# EAGLE board ControlBoard03_v03_short (EAGLE 7.7.0), part 1 of 3
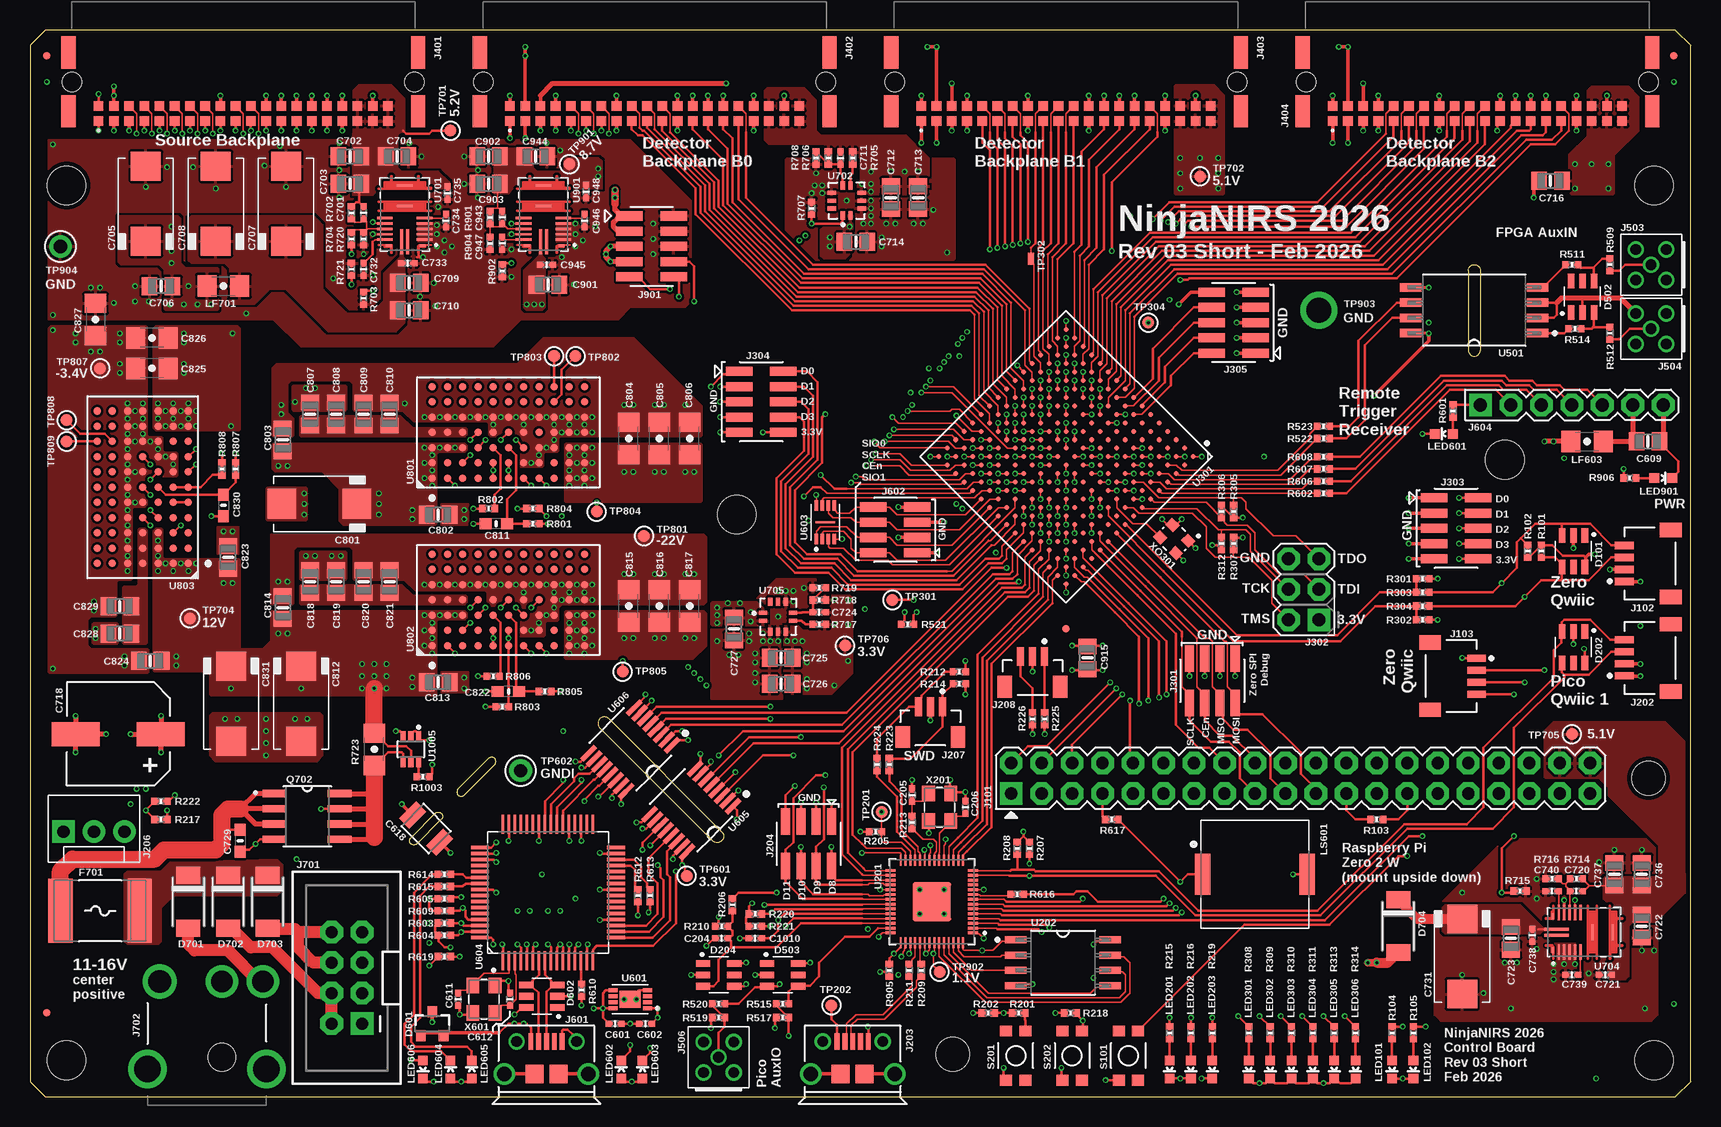
[diagram p10: board, top side]
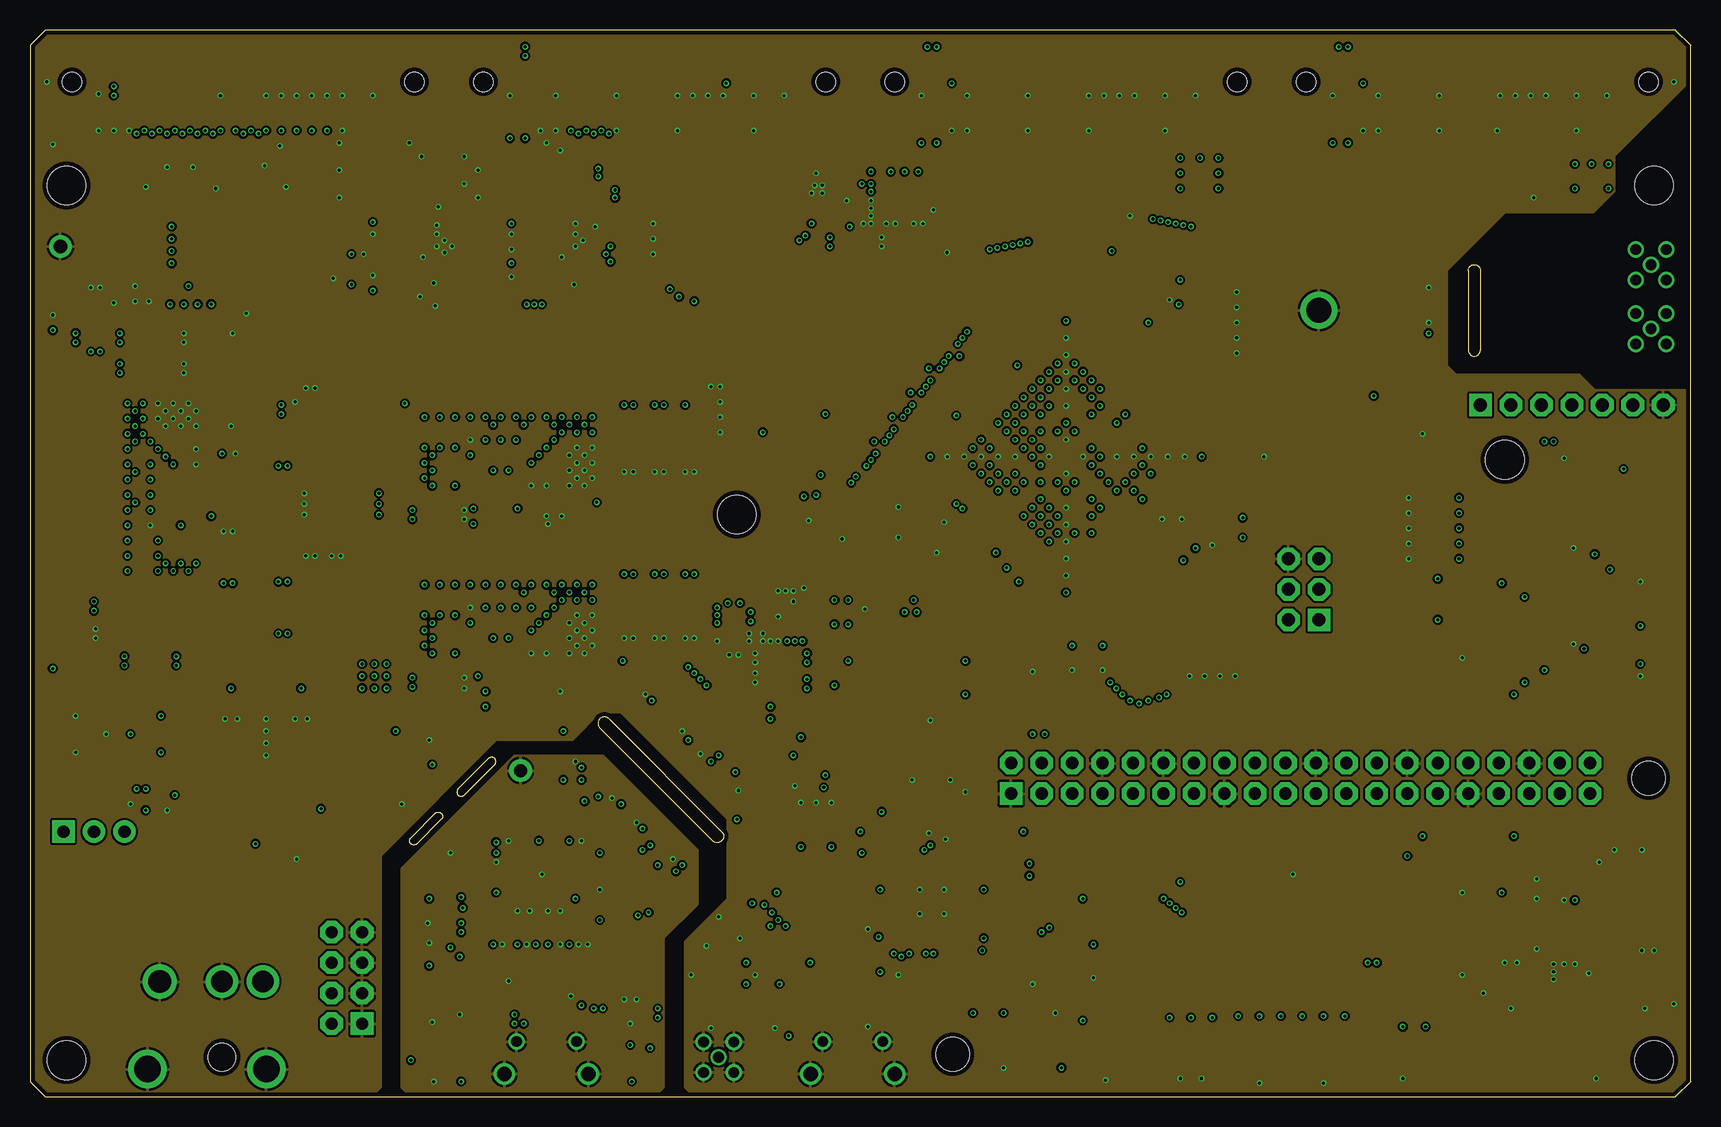
[diagram p11: board, inner layer Route2]
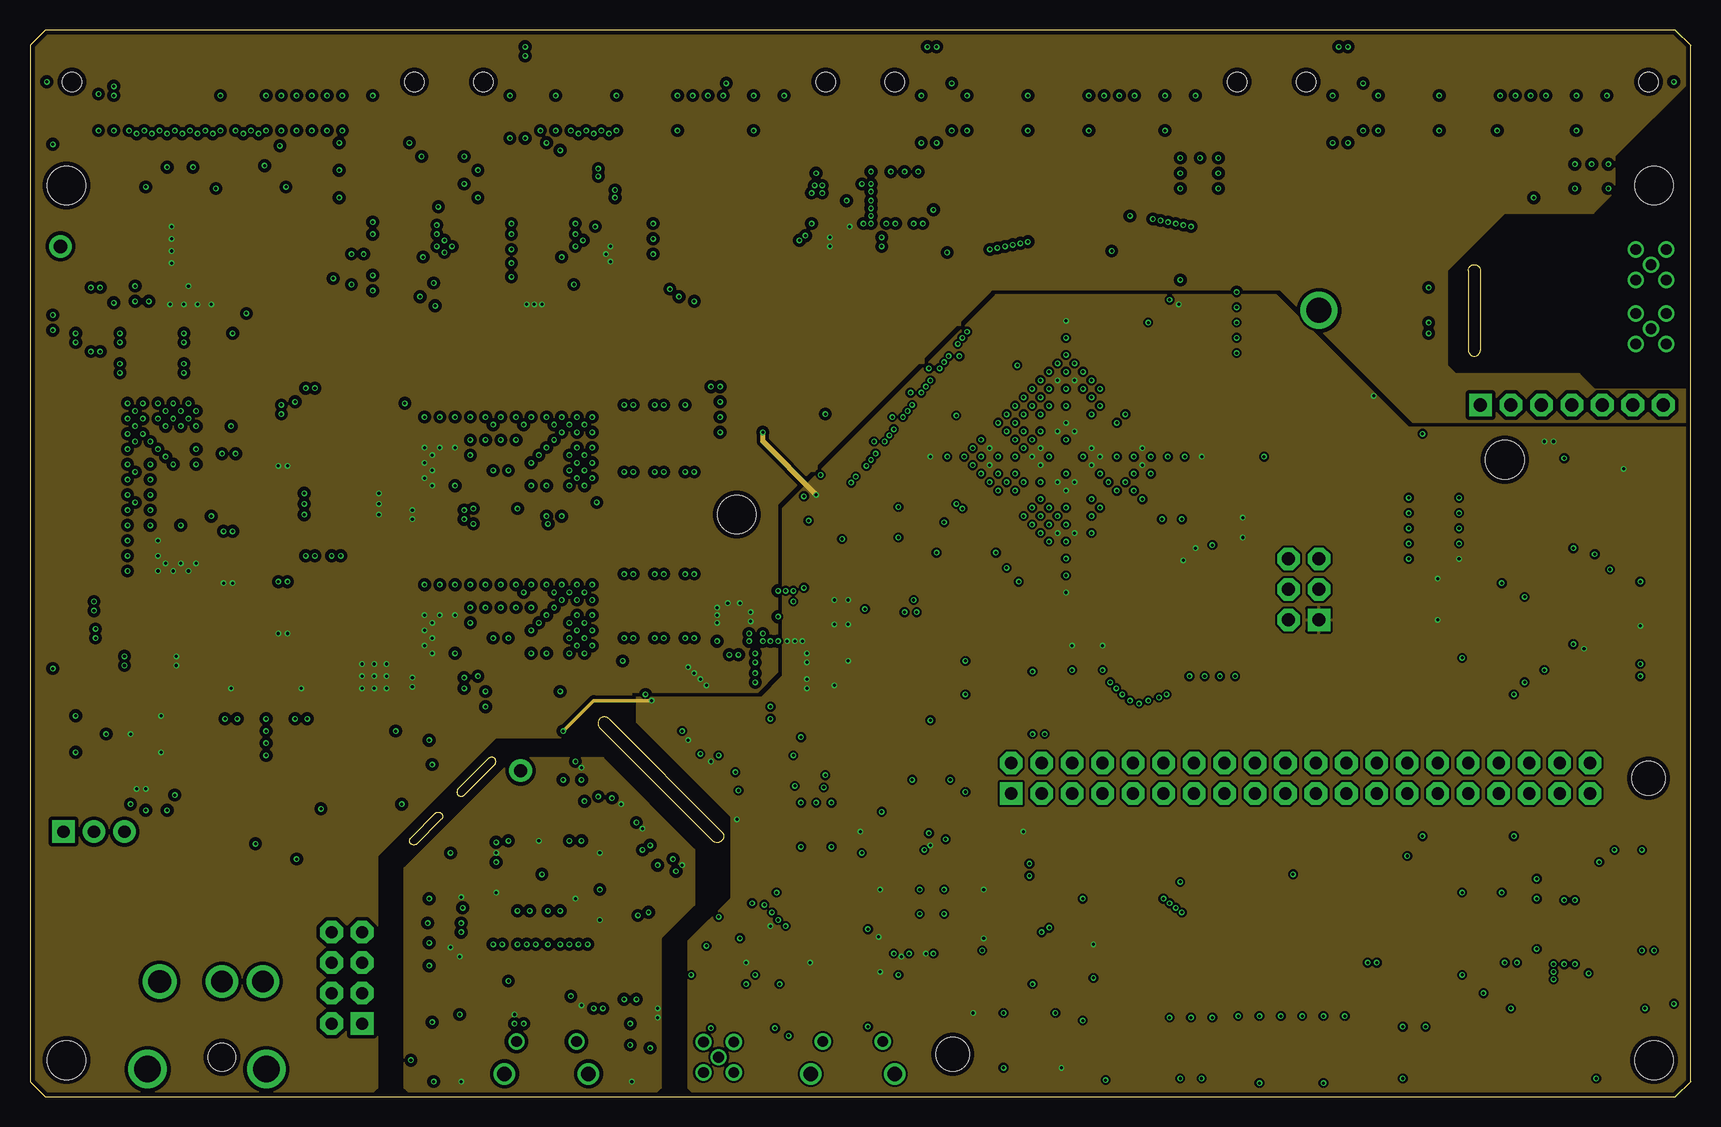
[diagram p12: board, inner layer Route3]
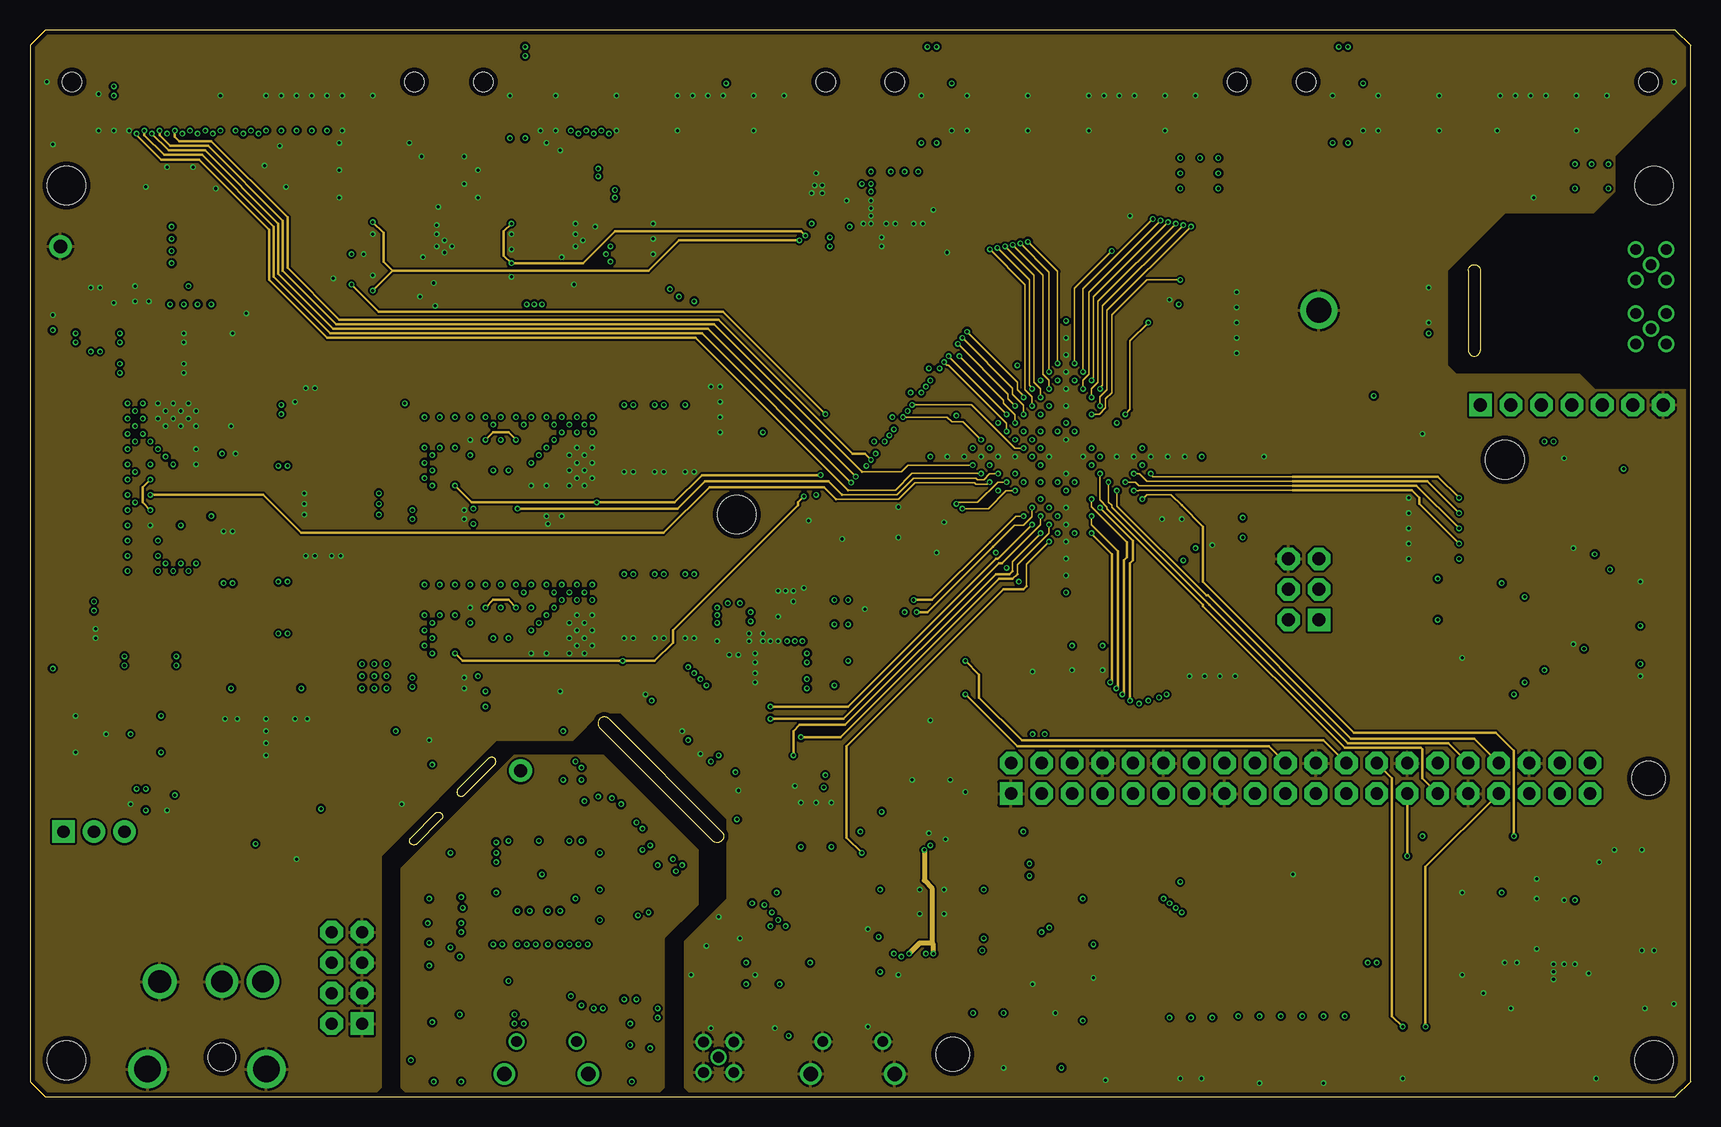
[diagram p13: board, inner layer Route14]
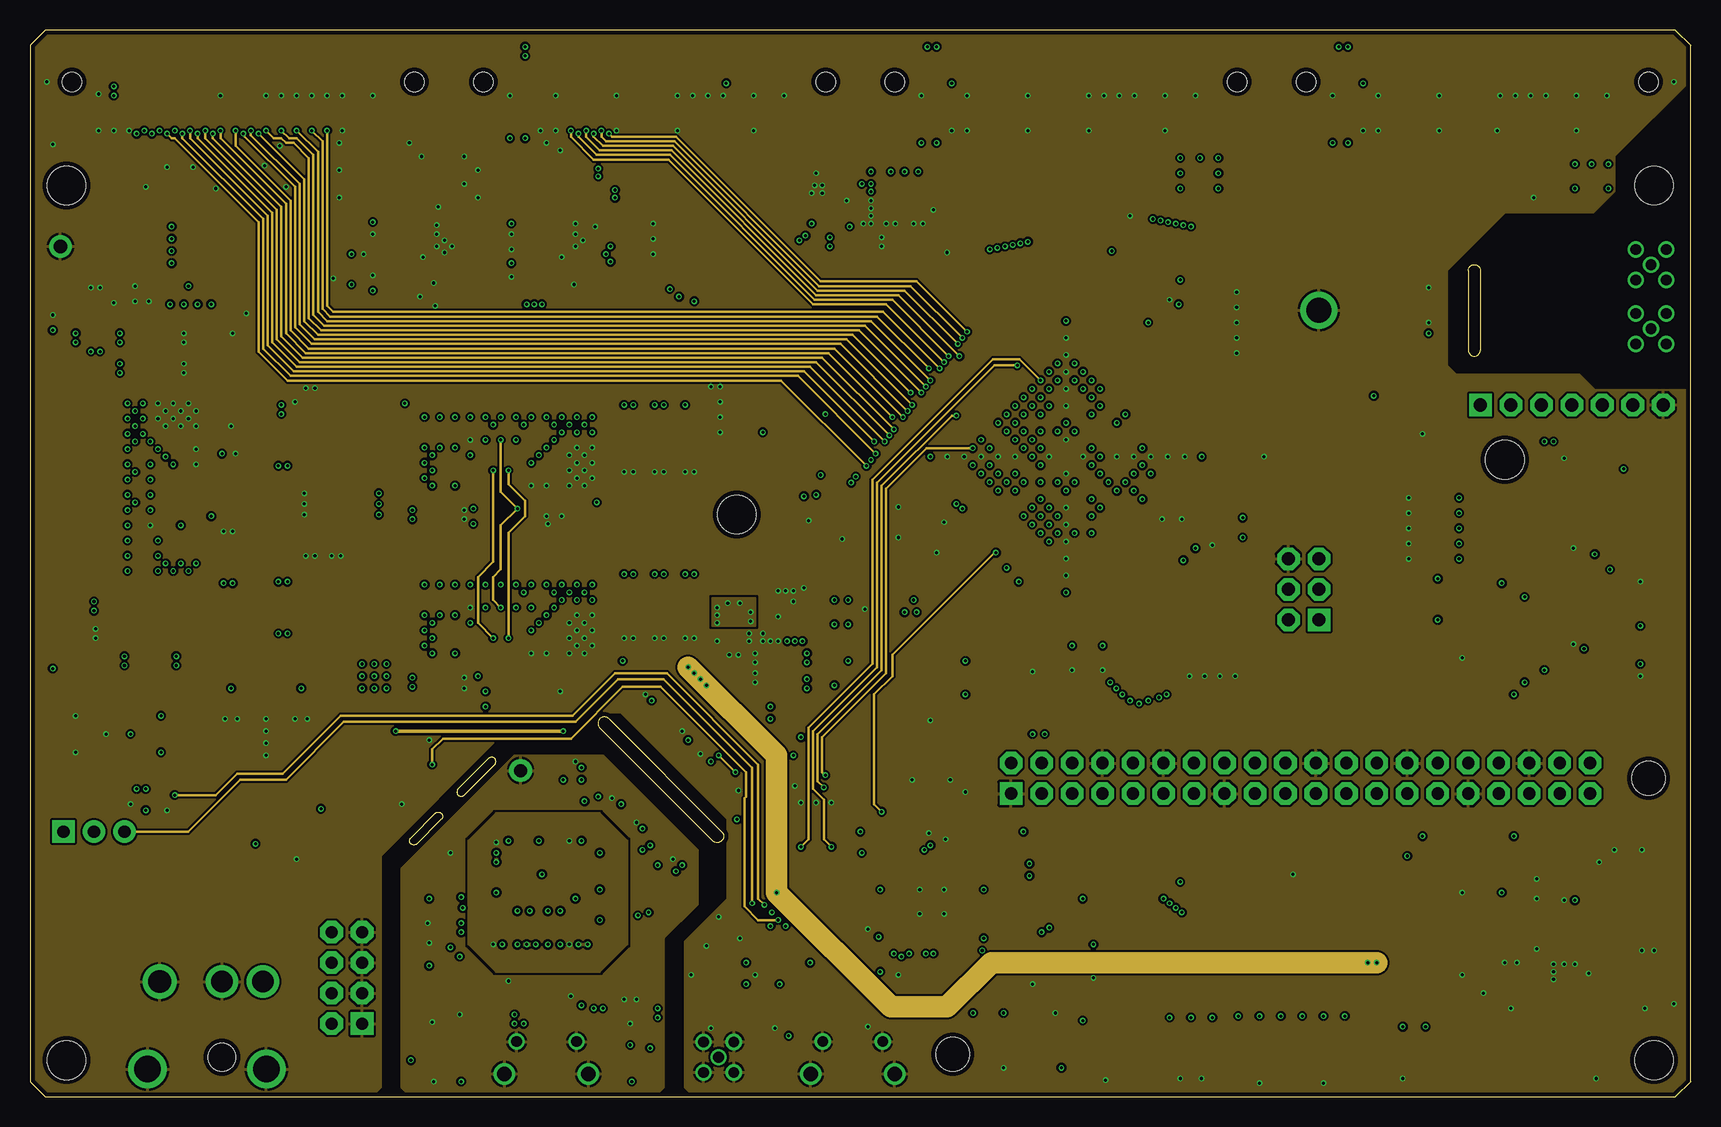
[diagram p14: board, inner layer Route15]
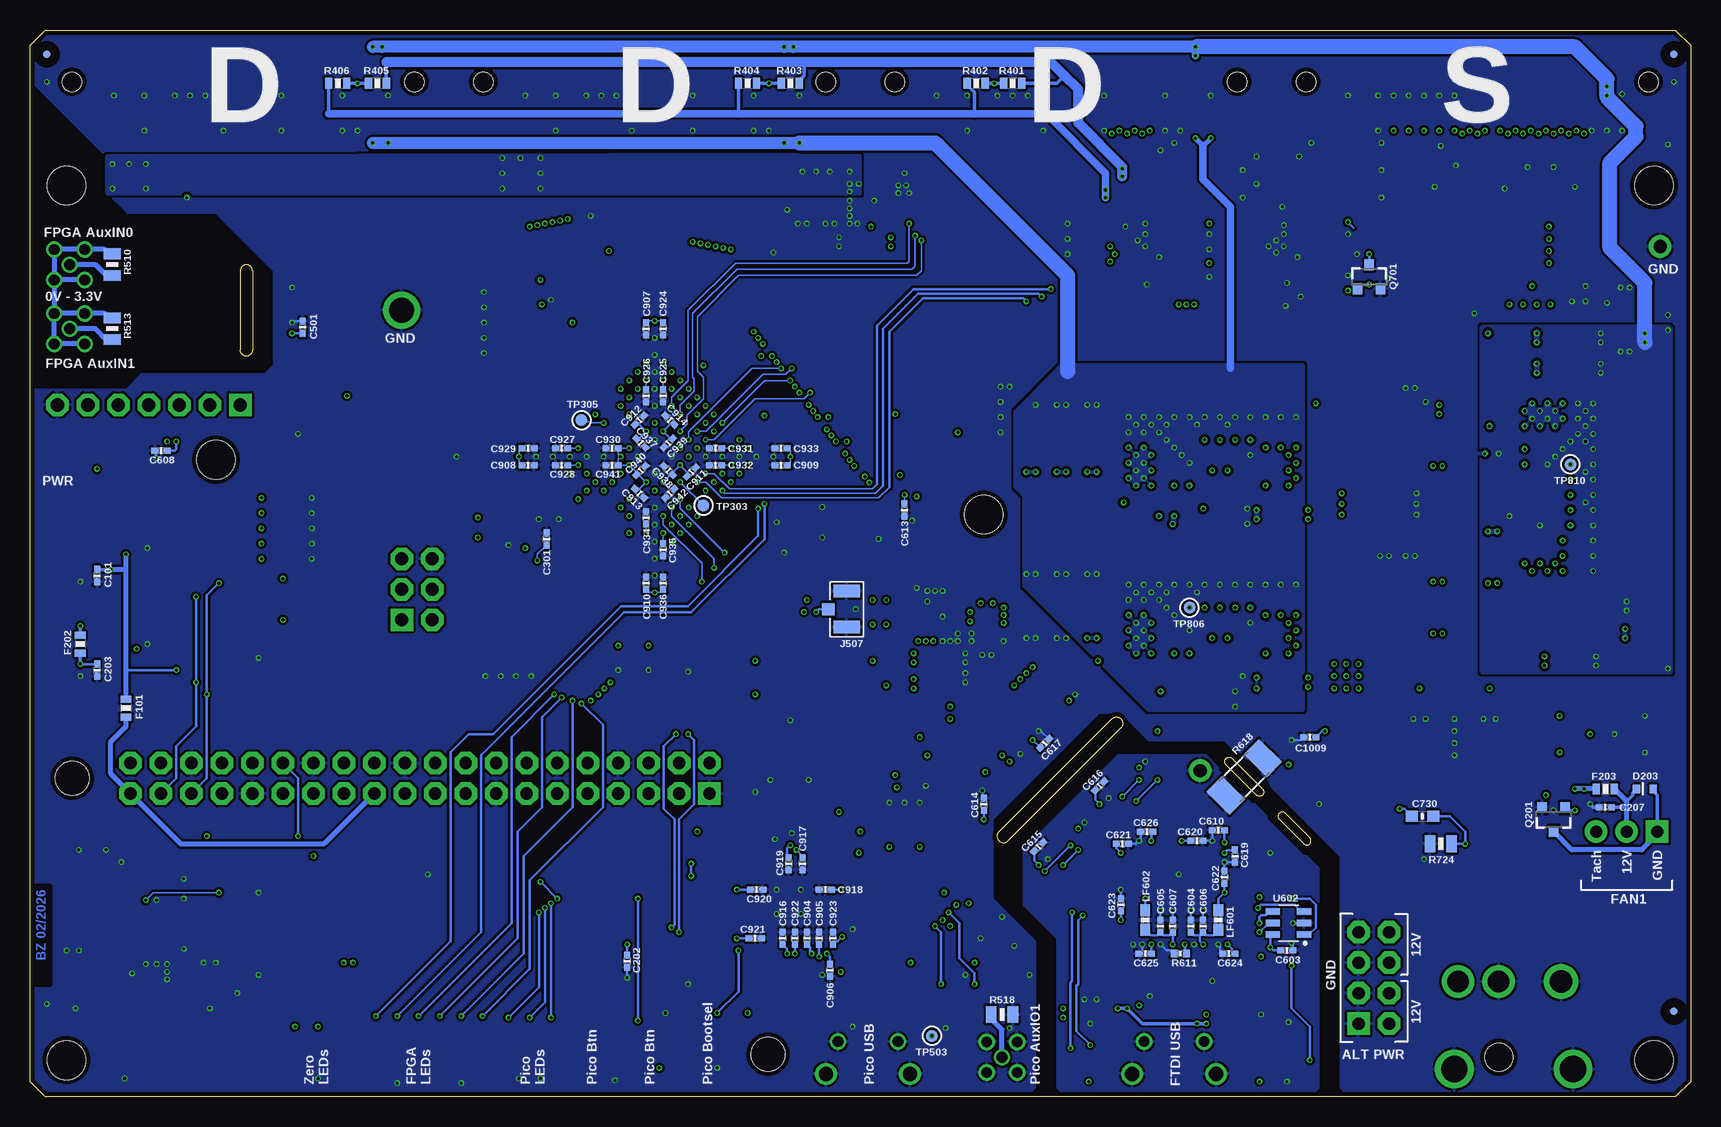
[diagram p15: board, bottom side, seen from below]

Size 138.43 x 88.9 mm. Coordinates in mm from the lower left corner, seen from the top.
Outline: 1.27,0 137.16,0 138.43,1.27 138.43,87.63 137.16,88.9 1.27,88.9 0,87.63 0,1.27 1.27,0
Outline: 48.26,31.5 57.66,22.1 arc-180 56.9,21.34 47.5,30.73 arc-180 48.26,31.5
Outline: 33.78,23.62 31.75,21.59 arc180 32.26,21.08 34.29,23.11 arc180 33.78,23.62
Outline: 35.69,25.65 38.23,28.19 arc-180 38.73,27.69 36.2,25.15 arc-180 35.69,25.65
Outline: 119.89,68.83 119.89,62.23 arc180 120.9,62.23 120.9,68.83 arc180 119.89,68.83
Copper layers (1*2*3*14*15*16): Top 0.04318125mm / dielectric 0.11074375mm / Route2 0.017271875mm / dielectric 4mil / Route3 0.017271875mm / dielectric 0.925575mm / Route14 0.017271875mm / dielectric 4mil / Route15 0.017271875mm / dielectric 0.11074375mm / Bottom 0.04318125mm
Design rules "ControlBoard00_v01_DRCsnapshot *": minimum track width 5mil, minimum drill 10mil, track to track 5mil, track to pad 5mil, pad to pad 5mil, via to via 5mil, smd to smd 5mil, copper to edge 15mil, drill to drill 6mil, minimum pad ring 4mil, minimum via ring 4mil, stop-mask expansion 1.5mil, vias tented up to drill 12mil, thermal gap 8mil
Holes 3.2 mm at 3.05,3.05 135.38,3.05 3.05,75.95 135.38,75.95 122.94,53.09 58.93,48.51
Holes 2.8 mm at 134.92,26.54 76.92,3.54
tKeepout: area 132.3,72.9 to 138.4,79; area 0,72.9 to 6.1,79; area 0,0 to 6.1,6.1; area 132.3,0 to 138.4,6.1; area 55.9,45.5 to 62,51.6
tRestrict: 23 lines
bRestrict: 3 lines

## Footprints (pad centres in the part's own frame; a part is rotated, then mirrored left to right if it is on the bottom)
0402-CAP = smd 0.6 x 0.5: 1 -0.5,0; 2 0.5,0
0805-CAP = smd 1.3 x 1.5: 1 -0.95,0; 2 0.95,0
1210 = smd 1.2 x 2: 1 -1.6,0; 2 1.6,0
2917-CAP = smd 2.4 x 2.5: N 3.125,0; P -3.125,0
CAP-SMD-POL-8X10 = smd 2 x 4: N 0,-3.55; P 0,3.55
0603-CAP = smd 1 x 0.9: 1 -0.9,0; 2 0.9,0
1206 = smd 1.6 x 1.8: 1 -1.35,0; 2 1.35,0
SOT23-6 = smd 1.2 x 0.55: 1 -1.3,0.95; 2 -1.3,0; 3 -1.3,-0.95; 4 1.3,-0.95; 5 1.3,0; 6 1.3,0.95
SOD523 = smd 0.6 x 0.7: A -0.7,0; C 0.7,0
SOT23-3 = smd 0.9 x 0.8: 1 -1,0.95; 2 -1,-0.95; 3 1,0
SOD128 = smd 1.4 x 2: A -2.2,0; C 2.2,0
0603-RES = smd 0.6 x 0.9: 1 -0.75,0; 2 0.75,0
2920-FUSE = smd 2.032 x 5.334: 1 -3.302,0; 2 3.302,0
MICRO-FIDUCIAL = smd 0.635 x 0.635: 1 0,0
M20X2_PTH = drill 1.016 pad 1.88 square: 1 -1.27,24.13 | drill 1.016 pad 1.88 octagon: 2 1.27,24.13; 3 -1.27,21.59; 4 1.27,21.59; 5 -1.27,19.05; 6 1.27,19.05; 7 -1.27,16.51; 8 1.27,16.51; 9 -1.27,13.97; 10 1.27,13.97; 11 -1.27,11.43; 12 1.27,11.43; 13 -1.27,8.89; 14 1.27,8.89; 15 -1.27,6.35; 16 1.27,6.35; 17 -1.27,3.81; 18 1.27,3.81; 19 -1.27,1.27; 20 1.27,1.27; 21 -1.27,-1.27; 22 1.27,-1.27; 23 -1.27,-3.81; 24 1.27,-3.81; 25 -1.27,-6.35; 26 1.27,-6.35; 27 -1.27,-8.89; 28 1.27,-8.89; 29 -1.27,-11.43; 30 1.27,-11.43; 31 -1.27,-13.97; 32 1.27,-13.97; 33 -1.27,-16.51; 34 1.27,-16.51; 35 -1.27,-19.05; 36 1.27,-19.05; 37 -1.27,-21.59; 38 1.27,-21.59; 39 -1.27,-24.13; 40 1.27,-24.13
M04X1_JST_SH_SM_RA = smd 0.6 x 1.55: 1 -1.5,4.775; 2 -0.5,4.775; 3 0.5,4.775; 4 1.5,4.775 | smd 1.2 x 1.8: PAD1 -2.8,0.9; PAD2 2.8,0.9
USB-MICRO = smd 0.4 x 1.4: 1 -1.3,2.7; 2 -0.65,2.7; 3 0,2.7; 4 0.65,2.7; 5 1.3,2.7 | drill 0.9: SH1 -2.5,2.7; SH2 2.5,2.7 | drill 1.2: SH3 -3.5,0; SH6 3.5,0 | smd 1.5 x 1.55: SH4 -1,0; SH5 1,0
M04X2_0.050_SMD_NO_CREAM = smd 2.21 x 0.762: 1 -1.841,1.905; 2 1.841,1.905; 3 -1.841,0.635; 4 1.841,0.635; 5 -1.841,-0.635; 6 1.841,-0.635; 7 -1.841,-1.905; 8 1.841,-1.905
MOLEX-1X3 = drill 1.016 pad 1.88 square: 1 0,0 | drill 1.016 pad 1.88: 2 2.54,0; 3 5.08,0
M03X1_JST_SH_SM = smd 0.6 x 1.55: 1 -1,-3.425; 2 0,-3.425; 3 1,-3.425 | smd 1.2 x 1.8: PAD1 -2.3,-0.9; PAD2 2.3,-0.9
2X3-NS = drill 1.1 pad 1.88 square: 1 -2.54,-1.27 | drill 1.1 pad 1.88 octagon: 2 -2.54,1.27; 3 0,-1.27; 4 0,1.27; 5 2.54,-1.27; 6 2.54,1.27
M05X2_0.050_SMD_NO_CREAM = smd 2.21 x 0.762: 1 -1.841,2.54; 2 1.841,2.54; 3 -1.841,1.27; 4 1.841,1.27; 5 -1.841,0; 6 1.841,0; 7 -1.841,-1.27; 8 1.841,-1.27; 9 -1.841,-2.54; 10 1.841,-2.54
M20X2_HARFLEX_M = smd 0.8 x 0.8: A1 12.065,2; A2 10.795,2; A3 9.525,2; A4 8.255,2; A5 6.985,2; A6 5.715,2; A7 4.445,2; A8 3.175,2; A9 1.905,2; A10 0.635,2; A11 -0.635,2; A12 -1.905,2; A13 -3.175,2; A14 -4.445,2; A15 -5.715,2; A16 -6.985,2; A17 -8.255,2; A18 -9.525,2; A19 -10.795,2; A20 -12.065,2; B1 12.065,3.27; B2 10.795,3.27; B3 9.525,3.27; B4 8.255,3.27; B5 6.985,3.27; B6 5.715,3.27; B7 4.445,3.27; B8 3.175,3.27; B9 1.905,3.27; B10 0.635,3.27; B11 -0.635,3.27; B12 -1.905,3.27; B13 -3.175,3.27; B14 -4.445,3.27; B15 -5.715,3.27; B16 -6.985,3.27; B17 -8.255,3.27; B18 -9.525,3.27; B19 -10.795,3.27; B20 -12.065,3.27 | smd 1.2 x 2.7: P$17 -14.575,2.45; P$18 -14.575,-2.45; P$19 14.575,2.45; P$20 14.575,-2.45 | hole 1.6: -14.275,0; 14.275,0
MMCX_PTH_RA = drill 0.9: C 0,0; G@1 -1.27,1.27; G@2 -1.27,-1.27; G@3 1.27,-1.27; G@4 1.27,1.27
U.FL = smd 2.2 x 1.05: P$1 0,1.5; P$2 0,-1.5 | smd 1.05 x 1: P$3 1.525,0
M07X1_PTH = drill 1.1 pad 1.88 square: 1 -7.62,0 | drill 1.1 pad 1.88 octagon: 2 -5.08,0; 3 -2.54,0; 4 0,0; 5 2.54,0; 6 5.08,0; 7 7.62,0
M04X2-SHROUDED = drill 1.016 pad 1.88 square: 1 -1.27,3.81 | drill 1.016 pad 1.88 octagon: 2 1.27,3.81; 3 -1.27,1.27; 4 1.27,1.27; 5 -1.27,-1.27; 6 1.27,-1.27; 7 -1.27,-3.81; 8 1.27,-3.81
PJ051AH = drill 1.8: CENTER 6.3,-3.4; SWITCH 6.3,0 | drill 2.2: SHIELD1 -1,6.2; SHIELD2 -1,-3.7 | drill 1.9: SLEEVE 6.3,5.2 | hole 2.3: 0,0
LED-0603 = smd 0.8 x 0.8: A 0,-0.75; C 0,0.75
0603-FER = smd 1 x 0.8: 1 -0.8,0; 2 0.8,0
XDCR_PKMCS0909E4000-R1 = smd 1.3 x 3.4: 1 -4.35,0; 2 4.35,0
SO08 = smd 2 x 0.6: 1 -2.7,1.905; 2 -2.7,0.635; 3 -2.7,-0.635; 4 -2.7,-1.905; 5 2.7,-1.905; 6 2.7,-0.635; 7 2.7,0.635; 8 2.7,1.905
0402-RES = smd 0.6 x 0.6: 1 -0.5,0; 2 0.5,0
0805 = smd 0.9 x 1.4: 1 -0.9,0; 2 0.9,0
R2010 = smd 1.8 x 2.7: 1 -2.2,0; 2 2.2,0
TACTILE_SWITCH_SMD-3 = smd 0.9 x 1: 1 -2.05,0.8; 2 2.05,0.8; 3 -2.05,-0.8; 4 2.05,-0.8
TESTPAD_ROUND = smd 1.016 x 1.016: P$1 0,0
TESTPAD_SMALL = smd 1.016 x 0.508: P$1 0,0
1X01 = drill 1.1 pad 1.88: 1 0,0
TURRET = drill 2.08: P$1 0,0
QFN-56_EP = smd 0.875 x 0.2: 1 -3.438,2.6; 2 -3.438,2.2; 3 -3.438,1.8; 4 -3.438,1.4; 5 -3.438,1; 6 -3.438,0.6; 7 -3.438,0.2; 8 -3.438,-0.2; 9 -3.438,-0.6; 10 -3.438,-1; 11 -3.438,-1.4; 12 -3.438,-1.8; 13 -3.438,-2.2; 14 -3.438,-2.6; 29 3.438,-2.6; 30 3.438,-2.2; 31 3.438,-1.8; 32 3.438,-1.4; 33 3.438,-1; 34 3.438,-0.6; 35 3.438,-0.2; 36 3.438,0.2; 37 3.438,0.6; 38 3.438,1; 39 3.438,1.4; 40 3.438,1.8; 41 3.438,2.2; 42 3.438,2.6 | smd 0.2 x 0.875: 15 -2.6,-3.438; 16 -2.2,-3.438; 17 -1.8,-3.438; 18 -1.4,-3.438; 19 -1,-3.438; 20 -0.6,-3.438; 21 -0.2,-3.438; 22 0.2,-3.438; 23 0.6,-3.438; 24 1,-3.438; 25 1.4,-3.438; 26 1.8,-3.438; 27 2.2,-3.438; 28 2.6,-3.438; 43 2.6,3.438; 44 2.2,3.438; 45 1.8,3.438; 46 1.4,3.438; 47 1,3.438; 48 0.6,3.438; 49 0.2,3.438; 50 -0.2,3.438; 51 -0.6,3.438; 52 -1,3.438; 53 -1.4,3.438; 54 -1.8,3.438; 55 -2.2,3.438; 56 -2.6,3.438 | smd 3.2 x 3.2: PAD 0,0
SO08-208MIL = smd 1.778 x 0.584: 1 -3.937,1.905; 2 -3.937,0.635; 3 -3.937,-0.635; 4 -3.937,-1.905; 5 3.937,-1.905; 6 3.937,-0.635; 7 3.937,0.635; 8 3.937,1.905
LBGA-256 = smd 0.4 x 0.4: A1 -7.5,7.5; A2 -6.5,7.5; A3 -5.5,7.5; A4 -4.5,7.5; A5 -3.5,7.5; A6 -2.5,7.5; A7 -1.5,7.5; A8 -0.5,7.5; A9 0.5,7.5; A10 1.5,7.5; A11 2.5,7.5; A12 3.5,7.5; A13 4.5,7.5; A14 5.5,7.5; A15 6.5,7.5; A16 7.5,7.5; B1 -7.5,6.5; B2 -6.5,6.5; B3 -5.5,6.5; B4 -4.5,6.5; B5 -3.5,6.5; B6 -2.5,6.5; B7 -1.5,6.5; B8 -0.5,6.5; B9 0.5,6.5; B10 1.5,6.5; B11 2.5,6.5; B12 3.5,6.5; B13 4.5,6.5; B14 5.5,6.5; B15 6.5,6.5; B16 7.5,6.5; C1 -7.5,5.5; C2 -6.5,5.5; C3 -5.5,5.5; C4 -4.5,5.5; C5 -3.5,5.5; C6 -2.5,5.5; C7 -1.5,5.5; C8 -0.5,5.5; C9 0.5,5.5; C10 1.5,5.5; C11 2.5,5.5; C12 3.5,5.5; C13 4.5,5.5; C14 5.5,5.5; C15 6.5,5.5; C16 7.5,5.5; D1 -7.5,4.5; D2 -6.5,4.5; D3 -5.5,4.5; D4 -4.5,4.5; D5 -3.5,4.5; D6 -2.5,4.5; D7 -1.5,4.5; D8 -0.5,4.5; D9 0.5,4.5; D10 1.5,4.5; D11 2.5,4.5; D12 3.5,4.5; D13 4.5,4.5; D14 5.5,4.5; D15 6.5,4.5; D16 7.5,4.5; E1 -7.5,3.5; E2 -6.5,3.5; E3 -5.5,3.5; E4 -4.5,3.5; E5 -3.5,3.5; E6 -2.5,3.5; E7 -1.5,3.5; E8 -0.5,3.5; E9 0.5,3.5; E10 1.5,3.5; E11 2.5,3.5; E12 3.5,3.5; E13 4.5,3.5; E14 5.5,3.5; E15 6.5,3.5; E16 7.5,3.5; F1 -7.5,2.5; F2 -6.5,2.5; F3 -5.5,2.5; F4 -4.5,2.5; F5 -3.5,2.5; F6 -2.5,2.5; F7 -1.5,2.5; F8 -0.5,2.5; F9 0.5,2.5; F10 1.5,2.5; F11 2.5,2.5; F12 3.5,2.5; F13 4.5,2.5; F14 5.5,2.5; F15 6.5,2.5; F16 7.5,2.5; G1 -7.5,1.5; G2 -6.5,1.5; G3 -5.5,1.5; G4 -4.5,1.5; G5 -3.5,1.5; G6 -2.5,1.5; G7 -1.5,1.5; G8 -0.5,1.5; G9 0.5,1.5; G10 1.5,1.5; G11 2.5,1.5; G12 3.5,1.5; G13 4.5,1.5; G14 5.5,1.5; G15 6.5,1.5; G16 7.5,1.5; H1 -7.5,0.5; H2 -6.5,0.5; H3 -5.5,0.5; H4 -4.5,0.5; H5 -3.5,0.5; H6 -2.5,0.5; H7 -1.5,0.5; H8 -0.5,0.5; H9 0.5,0.5; H10 1.5,0.5; H11 2.5,0.5; H12 3.5,0.5; H13 4.5,0.5; H14 5.5,0.5; H15 6.5,0.5; H16 7.5,0.5; J1 -7.5,-0.5; J2 -6.5,-0.5; J3 -5.5,-0.5; J4 -4.5,-0.5; J5 -3.5,-0.5; J6 -2.5,-0.5; J7 -1.5,-0.5; J8 -0.5,-0.5; J9 0.5,-0.5; J10 1.5,-0.5; J11 2.5,-0.5; J12 3.5,-0.5; J13 4.5,-0.5; J14 5.5,-0.5; J15 6.5,-0.5; J16 7.5,-0.5; K1 -7.5,-1.5; K2 -6.5,-1.5; K3 -5.5,-1.5; K4 -4.5,-1.5; K5 -3.5,-1.5; K6 -2.5,-1.5; K7 -1.5,-1.5; K8 -0.5,-1.5; K9 0.5,-1.5; K10 1.5,-1.5; K11 2.5,-1.5; K12 3.5,-1.5; K13 4.5,-1.5; K14 5.5,-1.5; K15 6.5,-1.5; K16 7.5,-1.5; L1 -7.5,-2.5; L2 -6.5,-2.5; L3 -5.5,-2.5; L4 -4.5,-2.5; L5 -3.5,-2.5; L6 -2.5,-2.5; L7 -1.5,-2.5; L8 -0.5,-2.5; L9 0.5,-2.5; L10 1.5,-2.5; L11 2.5,-2.5; L12 3.5,-2.5; L13 4.5,-2.5; L14 5.5,-2.5; L15 6.5,-2.5; L16 7.5,-2.5; M1 -7.5,-3.5; M2 -6.5,-3.5; M3 -5.5,-3.5; M4 -4.5,-3.5; M5 -3.5,-3.5; M6 -2.5,-3.5; M7 -1.5,-3.5; M8 -0.5,-3.5; M9 0.5,-3.5; M10 1.5,-3.5; M11 2.5,-3.5; M12 3.5,-3.5; M13 4.5,-3.5; M14 5.5,-3.5; M15 6.5,-3.5; M16 7.5,-3.5; N1 -7.5,-4.5; N2 -6.5,-4.5; N3 -5.5,-4.5; N4 -4.5,-4.5; N5 -3.5,-4.5; N6 -2.5,-4.5; N7 -1.5,-4.5; N8 -0.5,-4.5; N9 0.5,-4.5; N10 1.5,-4.5; N11 2.5,-4.5; N12 3.5,-4.5; N13 4.5,-4.5; N14 5.5,-4.5; N15 6.5,-4.5; N16 7.5,-4.5; P1 -7.5,-5.5; P2 -6.5,-5.5; P3 -5.5,-5.5; P4 -4.5,-5.5; P5 -3.5,-5.5; P6 -2.5,-5.5; P7 -1.5,-5.5; P8 -0.5,-5.5; P9 0.5,-5.5; P10 1.5,-5.5; P11 2.5,-5.5; P12 3.5,-5.5; P13 4.5,-5.5; P14 5.5,-5.5; P15 6.5,-5.5; P16 7.5,-5.5; R1 -7.5,-6.5; R2 -6.5,-6.5; R3 -5.5,-6.5; R4 -4.5,-6.5; R5 -3.5,-6.5; R6 -2.5,-6.5; R7 -1.5,-6.5; R8 -0.5,-6.5; R9 0.5,-6.5; R10 1.5,-6.5; R11 2.5,-6.5; R12 3.5,-6.5; R13 4.5,-6.5; R14 5.5,-6.5; R15 6.5,-6.5; R16 7.5,-6.5; T1 -7.5,-7.5; T2 -6.5,-7.5; T3 -5.5,-7.5; T4 -4.5,-7.5; T5 -3.5,-7.5; T6 -2.5,-7.5; T7 -1.5,-7.5; T8 -0.5,-7.5; T9 0.5,-7.5; T10 1.5,-7.5; T11 2.5,-7.5; T12 3.5,-7.5; T13 4.5,-7.5; T14 5.5,-7.5; T15 6.5,-7.5; T16 7.5,-7.5
SO08L = smd 1.8 x 0.7: 1 -5.3,1.905; 2 -5.3,0.635; 3 -5.3,-0.635; 4 -5.3,-1.905; 5 5.3,-1.905; 6 5.3,-0.635; 7 5.3,0.635; 8 5.3,1.905
DFN8_2X3MM = smd 0.75 x 0.3: 1 -1.45,0.75; 2 -1.45,0.25; 3 -1.45,-0.25; 4 -1.45,-0.75; 5 1.45,-0.75; 6 1.45,-0.25; 7 1.45,0.25; 8 1.45,0.75 | smd 1.75 x 1.45: P 0,0
USON8L-2X3MM_APM = smd 0.85 x 0.3: 1 -1.4,0.75; 2 -1.4,0.25; 3 -1.4,-0.25; 4 -1.4,-0.75; 5 1.4,-0.75; 6 1.4,-0.25; 7 1.4,0.25; 8 1.4,0.75 | smd 0.2 x 1.6: PAD 0,0
QFP50P1200X1200X160-64N = smd 1.56 x 0.28: 1 -5.68,3.75; 2 -5.68,3.25; 3 -5.68,2.75; 4 -5.68,2.25; 5 -5.68,1.75; 6 -5.68,1.25; 7 -5.68,0.75; 8 -5.68,0.25; 9 -5.68,-0.25; 10 -5.68,-0.75; 11 -5.68,-1.25; 12 -5.68,-1.75; 13 -5.68,-2.25; 14 -5.68,-2.75; 15 -5.68,-3.25; 16 -5.68,-3.75; 33 5.68,-3.75; 34 5.68,-3.25; 35 5.68,-2.75; 36 5.68,-2.25; 37 5.68,-1.75; 38 5.68,-1.25; 39 5.68,-0.75; 40 5.68,-0.25; 41 5.68,0.25; 42 5.68,0.75; 43 5.68,1.25; 44 5.68,1.75; 45 5.68,2.25; 46 5.68,2.75; 47 5.68,3.25; 48 5.68,3.75 | smd 0.28 x 1.56: 17 -3.75,-5.68; 18 -3.25,-5.68; 19 -2.75,-5.68; 20 -2.25,-5.68; 21 -1.75,-5.68; 22 -1.25,-5.68; 23 -0.75,-5.68; 24 -0.25,-5.68; 25 0.25,-5.68; 26 0.75,-5.68; 27 1.25,-5.68; 28 1.75,-5.68; 29 2.25,-5.68; 30 2.75,-5.68; 31 3.25,-5.68; 32 3.75,-5.68; 49 3.75,5.68; 50 3.25,5.68; 51 2.75,5.68; 52 2.25,5.68; 53 1.75,5.68; 54 1.25,5.68; 55 0.75,5.68; 56 0.25,5.68; 57 -0.25,5.68; 58 -0.75,5.68; 59 -1.25,5.68; 60 -1.75,5.68; 61 -2.25,5.68; 62 -2.75,5.68; 63 -3.25,5.68; 64 -3.75,5.68
SSOP16 = smd 1.6 x 0.406: 1 -2.692,2.223; 2 -2.692,1.587; 3 -2.692,0.953; 4 -2.692,0.318; 5 -2.692,-0.318; 6 -2.692,-0.953; 7 -2.692,-1.587; 8 -2.692,-2.223; 9 2.692,-2.223; 10 2.692,-1.587; 11 2.692,-0.953; 12 2.692,-0.318; 13 2.692,0.318; 14 2.692,0.953; 15 2.692,1.587; 16 2.692,2.223
QFN-24-MPS_FULL_CREAM = smd 0.5 x 0.2: 1_24 -1.5,2.6; 20_21 1.35,2.6 | smd 1.3 x 0.2: 2 -1.65,2.1; 3 -1.65,1.65; 4 -1.65,1.2; 5 -1.65,0.75; 6 -1.65,0.3; 7_8_13_14 0,-0.7; 9_10_11_12 0,-2.4; 15 1.65,0.3; 16 1.65,0.75; 17 1.65,1.2; 18 1.65,1.65; 19 1.65,2.1 | smd 0.25 x 2.05: 22 0.25,2.275; 23 -0.25,2.275
RPL-30 = smd 0.7 x 0.35: 1 -1.25,0.325; 2 -1.25,-0.325; 6 1.25,-0.325; 7 1.25,0.325 | smd 0.35 x 0.7: 3 -0.65,-1.25; 4 0,-1.25; 5 0.65,-1.25; 8 0.65,1.25; 9 0,1.25; 10 -0.65,1.25
BGA-77 = smd 0.63 x 0.63: A1 -3.81,6.35; A2 -2.54,6.35; A3 -1.27,6.35; A4 0,6.35; A5 1.27,6.35; A6 2.54,6.35; A7 3.81,6.35; B1 -3.81,5.08; B2 -2.54,5.08; B3 -1.27,5.08; B4 0,5.08; B5 1.27,5.08; B6 2.54,5.08; B7 3.81,5.08; C1 -3.81,3.81; C2 -2.54,3.81; C3 -1.27,3.81; C4 0,3.81; C5 1.27,3.81; C6 2.54,3.81; C7 3.81,3.81; D1 -3.81,2.54; D2 -2.54,2.54; D3 -1.27,2.54; D4 0,2.54; D5 1.27,2.54; D6 2.54,2.54; D7 3.81,2.54; E1 -3.81,1.27; E2 -2.54,1.27; E3 -1.27,1.27; E4 0,1.27; E5 1.27,1.27; E6 2.54,1.27; E7 3.81,1.27; F1 -3.81,0; F2 -2.54,0; F3 -1.27,0; F4 0,0; F5 1.27,0; F6 2.54,0; F7 3.81,0; G1 -3.81,-1.27; G2 -2.54,-1.27; G3 -1.27,-1.27; G4 0,-1.27; G5 1.27,-1.27; G6 2.54,-1.27; G7 3.81,-1.27; H1 -3.81,-2.54; H2 -2.54,-2.54; H3 -1.27,-2.54; H4 0,-2.54; H5 1.27,-2.54; H6 2.54,-2.54; H7 3.81,-2.54; J1 -3.81,-3.81; J2 -2.54,-3.81; J3 -1.27,-3.81; J4 0,-3.81; J5 1.27,-3.81; J6 2.54,-3.81; J7 3.81,-3.81; K1 -3.81,-5.08; K2 -2.54,-5.08; K3 -1.27,-5.08; K4 0,-5.08; K5 1.27,-5.08; K6 2.54,-5.08; K7 3.81,-5.08; L1 -3.81,-6.35; L2 -2.54,-6.35; L3 -1.27,-6.35; L4 0,-6.35; L5 1.27,-6.35; L6 2.54,-6.35; L7 3.81,-6.35
SOT363 = smd 0.42 x 0.9: 1 -0.65,-1.05; 2 0,-1.05; 3 0.65,-1.05; 4 0.65,1.05; 5 0,1.05; 6 -0.65,1.05
CRYSTAL-3.2-2.5 = smd 1.3 x 1.05: 1 -1.15,-0.925; 2 1.15,-0.925; 3 1.15,0.925; 4 -1.15,0.925
TXO2520 = smd 0.9 x 0.8: 1 -0.925,-0.725; 2 0.925,-0.725; 3 0.925,0.725; 4 -0.925,0.725

## Placement (x,y rotation side)
C101  0.1u  [0402-CAP]  132.84,43.43 270 bottom
C202  0.1u  [0402-CAP]  88.65,11.3 270 bottom
C203  0.1u  [0402-CAP]  132.84,35.56 270 bottom
C204  0.1u  [0402-CAP]  57.66,13.21 180 top
C205  27p  [0402-CAP]  73.53,25.15 90 top
C206  27p  [0402-CAP]  77.98,24.13 90 top
C207  0.1u  [0402-CAP]  7.11,24.13 180 bottom
C301  0.1u  [0402-CAP]  95.38,46.48 90 bottom
C501  0.1u  [0402-CAP]  115.7,64.14 90 bottom
C601  4.7u  [0402-CAP]  48.77,6.1 0 top
C602  4.7u  [0402-CAP]  51.31,6.1 180 top
C603  0.1u  [0402-CAP]  33.66,12.19 0 bottom
C604  4.7u  [0402-CAP]  41.66,14.22 90 bottom
C605  4.7u  [0402-CAP]  44.2,14.22 90 bottom
C606  0.1u  [0402-CAP]  40.64,14.22 90 bottom
C607  0.1u  [0402-CAP]  43.18,14.22 90 bottom
C608  0.1u  [0402-CAP]  127.51,53.85 180 bottom
C609  22u  [0805-CAP]  134.87,54.61 0 top
C610  4.7u  [0402-CAP]  39.37,22.23 180 bottom
C611  27p  [0402-CAP]  35.69,8.13 270 top
C612  27p  [0402-CAP]  40.01,8.13 90 top
C613  0.1u  [0402-CAP]  65.53,48.9 270 bottom
C614  0.1u  [0402-CAP]  58.93,24.38 90 bottom
C615  0.1u  [0402-CAP]  54.36,20.83 45 bottom
C616  0.1u  [0402-CAP]  49.28,25.91 45 bottom
C617  0.1u  [0402-CAP]  53.85,29.46 45 bottom
C618  DNP  [1210]  33.02,22.35 315 top
C619  0.1u  [0402-CAP]  37.97,20.07 270 bottom
C620  0.1u  [0402-CAP]  41.15,21.34 0 bottom
C621  0.1u  [0402-CAP]  47.37,21.08 0 bottom
C622  0.1u  [0402-CAP]  38.86,18.29 90 bottom
C623  0.1u  [0402-CAP]  47.5,16 90 bottom
C624  0.1u  [0402-CAP]  38.48,11.94 180 bottom
C625  0.1u  [0402-CAP]  45.47,11.94 180 bottom
C626  0.1u  [0402-CAP]  45.34,22.1 180 bottom
C701  39p  [0402-CAP]  27.81,73.66 270 top
C702  22u  [0805-CAP]  26.67,78.36 180 top
C703  22u  [0805-CAP]  26.67,76.07 180 top
C704  22u  [0805-CAP]  30.61,78.36 0 top
C705  100u/25V  [2917-CAP]  9.65,74.42 90 top
C706  22u  [0805-CAP]  10.92,67.56 180 top
C707  100u/25V  [2917-CAP]  21.34,74.42 90 top
C708  100u/25V  [2917-CAP]  15.49,74.42 90 top
C709  22u  [0805-CAP]  31.62,67.82 0 top
C710  22u  [0805-CAP]  31.62,65.53 0 top
C711  39p  [0402-CAP]  67.56,78.23 270 top
C712  22u  [0805-CAP]  71.75,74.93 270 top
C713  22u  [0805-CAP]  74.04,74.93 270 top
C714  22u  [0805-CAP]  68.83,71.25 0 top
C716  22u  [0805-CAP]  126.75,76.33 180 top
C718  330u/25V  [CAP-SMD-POL-8X10]  7.37,30.23 270 top
C720  39p  [0402-CAP]  128.91,17.14 180 top
C721  0.1u  [0402-CAP]  131.32,10.16 180 top
C722  22u  [0805-CAP]  134.37,14.22 270 top
C723  22u  [0805-CAP]  123.44,13.21 270 top
C724  39p  [0402-CAP]  65.79,40.39 180 top
C725  22u  [0805-CAP]  62.61,36.58 180 top
C726  22u  [0805-CAP]  62.61,34.42 180 top
C727  22u  [0805-CAP]  58.67,38.99 270 top
C729  10n  [0603-CAP]  17.53,21.34 270 top
C730  1n  [0603-CAP]  22.35,23.37 0 bottom
C731  100u/25V  [2917-CAP]  119.38,11.68 270 top
C732  0.1u  [0402-CAP]  27.81,68.96 270 top
C733  0.1u  [0402-CAP]  31.5,69.47 0 top
C734  DNP  [0402-CAP]  34.67,73.03 270 top
C735  0.1u  [0402-CAP]  34.8,75.31 270 top
C736  22u  [0805-CAP]  134.37,18.54 90 top
C737  22u  [0805-CAP]  132.08,18.54 90 top
C738  0.1u  [0402-CAP]  125.22,13.46 270 top
C739  DNP  [0402-CAP]  128.52,10.16 180 top
C740  0.1u  [0402-CAP]  126.87,17.14 180 top
C801  DNP  [2917-CAP]  24.13,49.4 180 top
C802  DNP  [0805-CAP]  34.04,48.51 0 top
C803  DNP  [0805-CAP]  21.08,54.74 90 top
C804  DNP  [1206]  49.91,54.86 90 top
C805  DNP  [1206]  52.45,54.86 90 top
C806  DNP  [1206]  54.99,54.86 90 top
C807  DNP  [0805-CAP]  23.37,56.9 90 top
C808  DNP  [0805-CAP]  25.53,56.9 90 top
C809  DNP  [0805-CAP]  27.81,56.9 90 top
C810  DNP  [0805-CAP]  29.97,56.9 90 top
C811  DNP  [0603-CAP]  38.86,47.75 180 top
C812  100u/25V  [2917-CAP]  22.61,32.77 270 top
C813  4.7u  [0805-CAP]  34.04,34.54 0 top
C814  4.7u  [0805-CAP]  21.08,40.77 90 top
C815  10u  [1206]  49.91,40.89 90 top
C816  10u  [1206]  52.45,40.89 90 top
C817  10u  [1206]  54.99,40.89 90 top
C818  4.7u  [0805-CAP]  23.37,42.93 90 top
C819  4.7u  [0805-CAP]  25.53,42.93 90 top
C820  4.7u  [0805-CAP]  27.81,42.93 90 top
C821  4.7u  [0805-CAP]  29.97,42.93 90 top
C822  1u  [0603-CAP]  39.88,33.78 180 top
C823  4.7u  [0805-CAP]  16.51,44.96 90 top
C824  4.7u  [0805-CAP]  10.03,36.32 180 top
C825  100u  [1206]  10.16,60.71 180 top
C826  100u  [1206]  10.16,63.25 180 top
C827  DNP  [1206]  5.46,64.77 270 top
C828  4.7u  [0805-CAP]  7.49,38.61 180 top
C829  4.7u  [0805-CAP]  7.49,40.89 180 top
C830  1u  [0603-CAP]  16.13,49.28 270 top
C831  100u/25V  [2917-CAP]  16.76,32.77 270 top
C901  22u  [0805-CAP]  43.18,67.69 0 top
C902  22u  [0805-CAP]  38.23,78.36 180 top
C903  22u  [0805-CAP]  38.23,76.07 180 top
C904  4.7u  [0402-CAP]  73.66,13.21 90 bottom
C905  4.7u  [0402-CAP]  72.64,13.21 90 bottom
C906  4.7u  [0402-CAP]  71.75,10.54 270 bottom
C907  4.7u  [0402-CAP]  87.07,64.01 270 bottom
C908  4.7u  [0402-CAP]  96.9,52.63 0 bottom
C909  4.7u  [0402-CAP]  75.82,52.63 180 bottom
C910  4.7u  [0402-CAP]  87.07,42.8 90 bottom
C911  4.7u  [0402-CAP]  83.31,52.07 45 bottom
C912  4.7u  [0402-CAP]  87.63,56.39 45 bottom
C913  4.7u  [0402-CAP]  87.63,50.29 315 bottom
C914  4.7u  [0402-CAP]  85.09,56.39 135 bottom
C915  22u  [0805-CAP]  88.14,36.58 270 top
C916  0.1u  [0402-CAP]  75.69,13.21 90 bottom
C917  0.1u  [0402-CAP]  74.04,19.43 270 bottom
C918  0.1u  [0402-CAP]  72.14,17.27 180 bottom
C919  0.1u  [0402-CAP]  75.18,19.43 270 bottom
C920  0.1u  [0402-CAP]  77.85,17.27 0 bottom
C921  0.1u  [0402-CAP]  77.98,13.21 0 bottom
C922  0.1u  [0402-CAP]  74.68,13.21 90 bottom
C923  0.1u  [0402-CAP]  71.5,13.21 90 bottom
C924  0.1u  [0402-CAP]  85.65,64.01 270 bottom
C925  0.1u  [0402-CAP]  85.65,58.42 270 bottom
C926  0.1u  [0402-CAP]  87.07,58.42 270 bottom
C927  0.1u  [0402-CAP]  94.11,54.05 180 bottom
C928  0.1u  [0402-CAP]  94.11,52.63 180 bottom
C929  0.1u  [0402-CAP]  96.9,54.05 0 bottom
C930  0.1u  [0402-CAP]  89.92,54.05 180 bottom
C931  0.1u  [0402-CAP]  81.28,54.05 180 bottom
C932  0.1u  [0402-CAP]  81.28,52.63 180 bottom
C933  0.1u  [0402-CAP]  75.82,54.05 180 bottom
C934  0.1u  [0402-CAP]  87.07,48.26 90 bottom
C935  0.1u  [0402-CAP]  85.65,45.59 270 bottom
C936  0.1u  [0402-CAP]  85.65,42.8 90 bottom
C937  0.1u  [0402-CAP]  87.5,54.48 315 bottom
C938  0.1u  [0402-CAP]  85.22,52.2 135 bottom
C939  0.1u  [0402-CAP]  85.22,54.48 225 bottom
C940  0.1u  [0402-CAP]  87.5,52.2 45 bottom
C941  0.1u  [0402-CAP]  89.92,52.63 180 bottom
C942  0.1u  [0402-CAP]  85.09,50.29 225 bottom
C943  39p  [0402-CAP]  39.37,73.28 270 top
C944  22u  [0805-CAP]  42.16,78.36 0 top
C945  0.1u  [0402-CAP]  43.05,69.34 0 top
C946  DNP  [0402-CAP]  46.23,73.03 270 top
C947  0.1u  [0402-CAP]  39.37,71.12 270 top
C948  0.1u  [0402-CAP]  46.35,75.44 270 top
C1009  0.1u  [0402-CAP]  31.75,29.97 180 bottom
C1010  0.1u  [0402-CAP]  60.45,13.21 180 top
D101  D1213A-02SO  [SOT23-6]  128.65,45.47 270 top
D202  D1213A-02SO  [SOT23-6]  128.65,37.47 270 top
D203  [SOD523]  3.81,25.65 180 bottom
D204  D1213A-02SO  [SOT23-6]  57.4,10.16 0 top
D502  D1213A-02SO  [SOT23-6]  129.41,66.67 90 top
D503  D1213A-02SO  [SOT23-6]  62.74,10.16 0 top
D601  PACDN042  [SOT23-3]  33.53,6.1 90 top
D602  D1213A-02SO  [SOT23-6]  42.67,8.38 180 top
D701  [SOD128]  13.21,16.26 90 top
D702  [SOD128]  16.51,16.26 90 top
D703  [SOD128]  19.81,16.26 90 top
D704  [SOD128]  114.05,14.22 90 top
F101  0ZCM0010FF2G  [0603-RES]  130.43,32.38 270 bottom
F202  0ZCM0010FF2G  [0603-RES]  134.24,37.72 270 bottom
F203  0ZCM0010FF2G  [0603-RES]  7.11,25.65 0 bottom
F701  2920L500/16MR  [2920-FUSE]  5.84,15.49 180 top
FID901  FIDUCIALUFIDUCIAL  [MICRO-FIDUCIAL]  1.4,6.99 0 top
FID902  FIDUCIALUFIDUCIAL  [MICRO-FIDUCIAL]  1.4,86.74 0 top
FID903  FIDUCIALUFIDUCIAL  [MICRO-FIDUCIAL]  137.03,86.74 0 top
FID904  FIDUCIALUFIDUCIAL  [MICRO-FIDUCIAL]  86.36,38.99 0 top
FID905  FIDUCIALUFIDUCIAL  [MICRO-FIDUCIAL]  1.4,7.11 0 bottom
FID906  FIDUCIALUFIDUCIAL  [MICRO-FIDUCIAL]  1.4,86.87 0 bottom
FID907  FIDUCIALUFIDUCIAL  [MICRO-FIDUCIAL]  137.03,86.87 0 bottom
J101  M20X2_PTH  [M20X2_PTH]  105.92,26.54 90 top
J102  M04X1_JST_SH_RA  [M04X1_JST_SH_SM_RA]  137.67,44.45 90 top
J103  M04X1_JST_SH_RA  [M04X1_JST_SH_SM_RA]  115.82,35.05 270 top
J202  M04X1_JST_SH_RA  [M04X1_JST_SH_SM_RA]  137.67,36.58 90 top
J203  USB-MICRO  [USB-MICRO]  68.58,1.91 0 top
J204  M04X2_0.050_SMD_NO_CREAM  [M04X2_0.050_SMD_NO_CREAM]  64.9,21.08 270 top
J206  [MOLEX-1X3]  2.79,22.1 0 top
J207  M03X1_JST_SH  [M03X1_JST_SH_SM]  75.06,29.08 180 top
J208  M03X1_JST_SH  [M03X1_JST_SH_SM]  83.57,33.27 180 top
J301  M04X2_0.050_SMD_NO_CREAM  [M04X2_0.050_SMD_NO_CREAM]  98.55,34.67 270 top
J302  M03X2PTH  [2X3-NS]  106.17,42.29 90 top
J303  M05X2_SMD_0.050_NOCREAM  [M05X2_0.050_SMD_NO_CREAM]  118.87,47.37 0 top
J304  M05X2_SMD_0.050_NOCREAM  [M05X2_0.050_SMD_NO_CREAM]  60.96,57.91 0 top
J305  M05X2_SMD_0.050_NOCREAM  [M05X2_0.050_SMD_NO_CREAM]  100.33,64.52 180 top
J401  M20X2_HARFLEX_M  [M20X2_HARFLEX_M]  17.78,84.58 180 top
J402  M20X2_HARFLEX_M  [M20X2_HARFLEX_M]  52.07,84.58 180 top
J403  M20X2_HARFLEX_M  [M20X2_HARFLEX_M]  86.36,84.58 180 top
J404  M20X2_HARFLEX_M  [M20X2_HARFLEX_M]  120.65,84.58 180 top
J503  SMA_MMCX_PTH_RA  [MMCX_PTH_RA]  135.13,69.34 90 top
J504  SMA_MMCX_PTH_RA  [MMCX_PTH_RA]  135.13,64.01 90 top
J506  SMA_MMCX_PTH_RA  [MMCX_PTH_RA]  57.4,3.3 0 top
J507  U.FL  [U.FL]  70.36,40.64 180 bottom
J601  USB-MICRO  [USB-MICRO]  43.05,1.91 0 top
J602  M04X2_0.050_SMD_NO_CREAM  [M04X2_0.050_SMD_NO_CREAM]  72.14,47.24 180 top
J604  M07X1_PTH  [M07X1_PTH]  128.52,57.66 0 top
J701  M04X2_SHROUDED  [M04X2-SHROUDED]  26.42,9.91 180 top
J702  POWERJACK_PJ051AH  [PJ051AH]  16,3.3 90 top
J901  M05X2_SMD_0.050_NOCREAM  [M05X2_0.050_SMD_NO_CREAM]  51.82,70.87 0 top
LED101  LTST-C191TBKT-5A  [LED-0603]  113.54,2.29 180 top
LED102  LTST-C191KGKT  [LED-0603]  115.32,2.29 180 top
LED201  LTST-C191KRKT  [LED-0603]  95,2.29 180 top
LED202  LTST-C191KGKT  [LED-0603]  96.77,2.29 180 top
LED203  LTST-C191KSKT  [LED-0603]  98.55,2.29 180 top
LED301  LTST-C191KRKT  [LED-0603]  101.6,2.29 180 top
LED302  LTST-C191KGKT  [LED-0603]  103.38,2.29 180 top
LED303  LTST-C191TBKT-5A  [LED-0603]  105.16,2.29 180 top
LED304  LTST-C191KSKT  [LED-0603]  106.93,2.29 180 top
LED305  LTST-C191KRKT  [LED-0603]  108.71,2.29 180 top
LED306  LTST-C191KGKT  [LED-0603]  110.49,2.29 180 top
LED601  LTST-C191KSKT  [LED-0603]  117.86,55.24 90 top
LED602  LTST-C191KGKT  [LED-0603]  49.28,2.29 0 top
LED603  LTST-C191KRKT  [LED-0603]  51.05,2.29 0 top
LED604  LTST-C191KGKT  [LED-0603]  35.05,2.29 0 top
LED605  LTST-C191KRKT  [LED-0603]  36.83,2.29 0 top
LED606  LTST-C191KRKT  [LED-0603]  32.77,2.29 180 top
LED901  LTST-C191KGKT  [LED-0603]  136.14,51.56 270 top
LF601  FERRITE0603  [0603-FER]  39.37,14.73 270 bottom
LF602  FERRITE0603  [0603-FER]  45.47,14.73 270 bottom
LF603  FERRITE1206  [1206]  129.79,54.61 0 top
LF701  FERRITE1206  [1206]  16.13,67.56 0 top
LS601  PKMCS0909E4000-R1  [XDCR_PKMCS0909E4000-R1]  102.11,18.54 0 top
Q201  MOSFET-NCHANNELSMD  [SOT23-3]  11.43,23.11 270 bottom
Q701  MOSFET-NCHANNELSMD  [SOT23-3]  26.8,68.33 90 bottom
Q702  MOSFET-PCHANNEL_SO8  [SO08]  23.11,23.37 0 top
R101  10k  [0402-RES]  125.98,45.47 90 top
R102  10k  [0402-RES]  124.84,45.47 270 top
R103  10k  [0402-RES]  112.27,23.11 180 top
R104  470  [0402-RES]  113.54,5.33 90 top
R105  470  [0402-RES]  115.32,5.33 90 top
R201  1k  [0402-RES]  82.42,6.99 180 top
R202  DNP  [0402-RES]  79.88,6.99 180 top
R205  100k  [0402-RES]  70.48,22.1 180 top
R206  47k  [0402-RES]  58.55,16 90 top
R207  10k  [0402-RES]  83.31,20.7 90 top
R208  10k  [0402-RES]  82.3,20.7 90 top
R209  27  [0402-RES]  74.3,10.54 270 top
R210  10k  [0402-RES]  57.66,14.22 0 top
R211  27  [0402-RES]  73.28,10.54 270 top
R212  DNP  [0402-RES]  77.47,35.43 180 top
R213  1.2k  [0402-RES]  73.53,22.86 90 top
R214  DNP  [0402-RES]  77.47,34.42 180 top
R215  470  [0402-RES]  95,5.33 90 top
R216  470  [0402-RES]  96.77,5.33 90 top
R217  100k  [0402-RES]  10.92,23.11 180 top
R218  10k  [0402-RES]  86.74,6.99 0 top
R219  470  [0402-RES]  98.55,5.33 90 top
R220  470  [0402-RES]  60.45,15.24 180 top
R221  100k  [0402-RES]  60.45,14.22 0 top
R222  470  [0402-RES]  10.92,24.64 180 top
R223  100  [0402-RES]  71.63,27.69 90 top
R224  100  [0402-RES]  70.61,27.69 90 top
R225  100  [0402-RES]  84.58,31.5 90 top
R226  100  [0402-RES]  83.57,31.5 90 top
R301  10k  [0402-RES]  116.08,43.18 0 top
R302  10k  [0402-RES]  116.08,39.75 0 top
R303  DNP  [0402-RES]  116.08,42.04 0 top
R304  DNP  [0402-RES]  116.08,40.89 0 top
R305  10k  [0402-RES]  100.33,48.77 270 top
R306  10k  [0402-RES]  99.31,48.77 90 top
R307  10k  [0402-RES]  100.33,46.1 90 top
R308  470  [0402-RES]  101.6,5.33 90 top
R309  470  [0402-RES]  103.38,5.33 90 top
R310  470  [0402-RES]  105.16,5.33 90 top
R311  470  [0402-RES]  106.93,5.33 90 top
R312  10k  [0402-RES]  99.31,46.1 90 top
R313  470  [0402-RES]  108.71,5.33 90 top
R314  470  [0402-RES]  110.49,5.33 90 top
R401  0  [0603-RES]  56.52,84.45 180 bottom
R402  DNP  [0603-RES]  59.56,84.45 0 bottom
R403  0  [0603-RES]  75.06,84.45 180 bottom
R404  DNP  [0603-RES]  78.61,84.45 0 bottom
R405  0  [0603-RES]  109.47,84.45 180 bottom
R406  DNP  [0603-RES]  112.78,84.45 0 bottom
R509  100  [0402-RES]  131.7,69.34 90 top
R510  DNP  [0805]  131.57,69.34 270 bottom
R511  470  [0402-RES]  128.52,69.34 180 top
R512  100  [0402-RES]  131.7,63.63 90 top
R513  DNP  [0805]  131.57,64.01 270 bottom
R514  470  [0402-RES]  128.78,64.01 180 top
R515  100  [0402-RES]  62.74,7.75 0 top
R517  10k  [0402-RES]  62.74,6.6 0 top
R518  DNP  [0805]  57.4,6.86 180 bottom
R519  10k  [0402-RES]  57.4,6.6 0 top
R520  100  [0402-RES]  57.4,7.75 0 top
R521  100  [0402-RES]  73.15,39.37 0 top
R522  100  [0402-RES]  107.82,54.86 180 top
R523  100  [0402-RES]  107.82,55.88 180 top
R601  470  [0402-RES]  118.62,57.15 270 top
R602  1k  [0402-RES]  107.82,50.29 0 top
R603  10k  [0402-RES]  34.54,14.48 180 top
R604  10k  [0402-RES]  34.54,13.46 180 top
R605  10k  [0402-RES]  34.54,16.51 0 top
R606  1k  [0402-RES]  107.82,51.31 0 top
R607  1k  [0402-RES]  107.82,52.32 0 top
R608  1k  [0402-RES]  107.82,53.34 0 top
R609  3.48k  [0402-RES]  34.54,15.49 0 top
R610  1k  [0402-RES]  45.97,8.89 90 top
R611  12k  [0402-RES]  42.55,11.94 0 bottom
R612  1k  [0402-RES]  50.67,16.76 270 top
R613  1k  [0402-RES]  51.69,16.76 270 top
R614  1k  [0402-RES]  34.54,18.54 180 top
R615  1k  [0402-RES]  34.54,17.53 180 top
R616  1k  [0402-RES]  82.3,16.89 180 top
R617  1k  [0402-RES]  90.17,23.11 180 top
R618  4.7M  [R2010]  37.21,26.67 225 bottom
R619  1k  [0402-RES]  34.54,11.68 0 top
R702  47k  [0402-RES]  26.8,73.66 90 top
R703  100k  [0402-RES]  27.81,66.55 90 top
R704  6.2k  [0402-RES]  26.8,71.5 90 top
R705  1k  [0402-RES]  68.58,78.23 90 top
R706  47k  [0402-RES]  66.55,78.23 90 top
R707  100k  [0402-RES]  65.15,74.04 270 top
R708  8.66k  [0402-RES]  65.53,78.23 90 top
R714  47k  [0402-RES]  128.91,18.16 0 top
R715  100k  [0402-RES]  124.21,17.14 180 top
R716  6.2k  [0402-RES]  126.87,18.16 0 top
R717  1k  [0402-RES]  65.79,39.37 0 top
R718  47k  [0402-RES]  65.79,41.4 0 top
R719  15k  [0402-RES]  65.79,42.42 0 top
R720  6.2k  [0402-RES]  27.81,71.5 90 top
R721  100k  [0402-RES]  26.8,68.96 270 top
R723  0.01  [1206]  28.7,28.96 90 top
R724  10M  [0805]  20.83,21.08 0 bottom
R801  DNP  [0402-RES]  41.91,47.75 0 top
R802  DNP  [0402-RES]  38.23,49.02 0 top
R803  442k  [0402-RES]  39.37,32.51 180 top
R804  100k  [0402-RES]  41.91,49.02 0 top
R805  82  [0402-RES]  42.93,33.78 0 top
R806  180k  [0402-RES]  38.61,35.05 0 top
R807  15  [0402-RES]  17.14,52.32 90 top
R808  68k  [0402-RES]  16,52.32 90 top
R901  47k  [0402-RES]  38.35,73.28 90 top
R902  100k  [0402-RES]  39.37,68.83 90 top
R904  3.48k  [0402-RES]  38.35,71.12 90 top
R905  100  [0402-RES]  71.63,10.54 90 top
R906  1k  [0402-RES]  133.35,51.56 180 top
R1003  470  [0402-RES]  32.77,26.67 0 top
S101  SWITCH-MOMENTARY-2SMD-3  [TACTILE_SWITCH_SMD-3]  91.57,3.43 90 top
S201  SWITCH-MOMENTARY-2SMD-3  [TACTILE_SWITCH_SMD-3]  82.17,3.43 90 top
S202  SWITCH-MOMENTARY-2SMD-3  [TACTILE_SWITCH_SMD-3]  86.87,3.43 270 top
TP201  TESTPOINT_ROUND  [TESTPAD_ROUND]  70.99,23.75 0 top
TP202  TESTPOINT_ROUND  [TESTPAD_ROUND]  66.8,7.62 0 top
TP301  TESTPOINT_ROUND  [TESTPAD_ROUND]  71.88,41.4 0 top
TP302  TESTPOINTPADSMALL  [TESTPAD_SMALL]  83.44,69.85 90 top
TP303  TESTPOINT_ROUND  [TESTPAD_ROUND]  82.3,49.28 0 bottom
TP304  TESTPOINT_ROUND  [TESTPAD_ROUND]  93.22,64.52 0 top
TP305  TESTPOINT_ROUND  [TESTPAD_ROUND]  92.46,56.39 0 bottom
TP503  TESTPOINT_ROUND  [TESTPAD_ROUND]  63.25,5.08 90 bottom
TP601  TESTPOINT_ROUND  [TESTPAD_ROUND]  54.74,18.41 0 top
TP602  TESTPOINT1X01  [1X01]  40.89,27.18 270 top
TP701  TESTPOINT_ROUND  [TESTPAD_ROUND]  35.05,80.52 0 top
TP702  TESTPOINT_ROUND  [TESTPAD_ROUND]  97.54,76.71 180 top
TP704  TESTPOINT_ROUND  [TESTPAD_ROUND]  13.34,39.88 0 top
TP705  TESTPOINT_ROUND  [TESTPAD_ROUND]  128.52,30.23 0 top
TP706  TESTPOINT_ROUND  [TESTPAD_ROUND]  67.94,37.59 90 top
TP801  TESTPOINT_ROUND  [TESTPAD_ROUND]  51.18,46.74 270 top
TP802  TESTPOINT_ROUND  [TESTPAD_ROUND]  45.47,61.72 270 top
TP803  TESTPOINT_ROUND  [TESTPAD_ROUND]  43.69,61.72 270 top
TP804  TESTPOINT_ROUND  [TESTPAD_ROUND]  47.24,48.77 0 top
TP805  TESTPOINT_ROUND  [TESTPAD_ROUND]  49.4,35.43 0 top
TP806  TESTPOINT_ROUND  [TESTPAD_ROUND]  41.78,40.77 90 bottom
TP807  TESTPOINT_ROUND  [TESTPAD_ROUND]  5.84,60.71 180 top
TP808  TESTPOINT_ROUND  [TESTPAD_ROUND]  3.05,56.39 180 top
TP809  TESTPOINT_ROUND  [TESTPAD_ROUND]  3.05,54.61 180 top
TP810  TESTPOINT_ROUND  [TESTPAD_ROUND]  10.03,52.7 180 bottom
TP901  TESTPOINT_ROUND  [TESTPAD_ROUND]  44.96,77.72 45 top
TP902  TESTPOINT_ROUND  [TESTPAD_ROUND]  75.82,10.41 0 top
TP903  TESTPOINTTUR  [TURRET]  107.44,65.53 0 top
TP904  TESTPOINT1X01  [1X01]  2.54,70.87 0 top
U201  RP2040  [QFN-56_EP]  75.18,16.26 180 top
U202  W25Q_SO  [SO08-208MIL]  86.11,11.18 0 top
U301  MACHXO2_FTBGA256  [LBGA-256]  86.36,53.34 225 top
U501  TLP2270  [SO08L]  120.38,65.54 180 top
U601  MCP1755_DFN  [DFN8_2X3MM]  50.04,8.13 180 top
U602  93LC56  [SOT23-6]  33.53,14.48 180 bottom
U603  APS6404L_PAD  [USON8L-2X3MM_APM]  66.29,47.88 90 top
U604  FT2232H_QFP  [QFP50P1200X1200X160-64N]  43.18,17.02 90 top
U605  ISO7742_DBQ  [SSOP16]  55.12,23.88 225 top
U606  ISO7742_DBQ  [SSOP16]  50.04,28.96 225 top
U701  MPM3650  [QFN-24-MPS_FULL_CREAM]  31.24,73.53 180 top
U702  RPL-30  [RPL-30]  68.07,74.68 90 top
U704  MPM3650  [QFN-24-MPS_FULL_CREAM]  129.54,13.72 90 top
U705  RPL-30  [RPL-30]  62.36,40.01 0 top
U801  DNP  [BGA-77]  39.88,55.37 90 top
U802  LTM4651  [BGA-77]  39.88,41.4 90 top
U803  LTM4651  [BGA-77]  9.4,50.8 180 top
U901  MPM3650  [QFN-24-MPS_FULL_CREAM]  42.8,73.53 180 top
U1005  INA21X_DCK  [SOT363]  31.75,28.96 180 top
X201  403I35D12M00000  [CRYSTAL-3.2-2.5]  75.82,24.13 270 top
X601  403I35D12M00000  [CRYSTAL-3.2-2.5]  37.85,8.13 270 top
XO301  OSCILLATOR_TXO2520  [TXO2520]  95.38,46.48 135 top

## Tracks (layer width: path | path; a pad name or v marks a point on that pad's centre or on a via)
AUXIO0
  Top 0.127: U301.B3 95.58,52.63 96.01,52.2 104.01,52.2 106.68,54.86 106.68,55.24 R523.2
AUXIO0PRE
  Top 0.203: R511.2 127.76,69.08 127.75,69.08 126.24,67.56 125.8,67.56 U501.4
AUXIO1
  Top 0.127: U301.A3 95.65,51.93 95.76,51.82 104.27,51.82 R522.2
AUXIO1PRE
  Top 0.203: U501.1 127.91,63.64 R514.2
AUXIO2  (via drill 0.25)
  Top 0.127: U301.H13 v83.53,49.1
  Top 0.203: v73.91,40.39 73.65,40.12 R521.2
  Route14 0.127: v83.53,49.1 83.53,48.35 82.8,47.62 82.04,47.62 80.26,45.85
  Route14 0.203: 80.26,45.85 74.8,40.39 v73.91,40.39
BOOTSEL
  Top 0.203: S201.4 82.97,6.39 82.93,6.43 82.93,6.98 R201.1
DETB_END_CYC0
  Top 0.127: U301.R7 82.82,59.67 81.79,60.71 81.79,66.17
  Top 0.203: J402.B15 57.78,80.64 58.55,79.88 58.55,74.55 64.52,68.58 79.38,68.58 81.79,66.17
DETB_END_CYC1
  Top 0.127: U301.P1 87.77,62.63 87.88,62.74 87.88,69.72
  Top 0.203: J403.B15 92.08,80.64 88.9,77.47 88.9,70.74 87.88,69.72
DETB_END_CYC2
  Top 0.127: U301.J1 91.31,59.05 91.69,59.44 91.69,65.28
  Top 0.203: J404.B15 126.36,80.39 126.11,80.14 124.33,80.14 113.16,68.96 95.38,68.96 91.69,65.28
DETB_RUN0
  Top 0.127: J402.A16 59.05,82.55 59.69,81.92 59.69,80.39 | 83.31,65.66 83.31,61.34 U301.T5
  Top 0.203: 59.69,80.39 59.69,74.93 65.28,69.34 79.63,69.34 83.31,65.66
DETB_RUN1  (via drill 0.25)
  Top 0.127: J403.A16 93.34,82.55 93.98,81.92 93.98,80.39 | U301.N3 v87.07,61.12
  Top 0.203: 93.98,80.39 93.98,80.01 90.17,76.2 v90.17,70.48
  Route14 0.127: v90.17,70.48 87.07,67.38 v87.07,61.12
DETB_RUN2  (via drill 0.25)
  Top 0.127: J404.A16 127.64,82.55 128.27,81.92 128.27,80.52 | U301.K5 v88.48,56.88
  Top 0.203: 128.27,80.52 127.13,79.38 125.09,79.38 113.92,68.2 96.65,68.2 96.52,68.07 v95.89,68.07
  Route14 0.127: v88.48,56.88 89.13,56.88 89.66,57.4 89.66,58.17 90.17,58.67 90.17,65.15 93.09,68.07 v95.89,68.07
DETB_SELECT00
  Top 0.127: U301.R9 81.41,58.29 80.26,59.44 80.26,65.66
  Top 0.203: J402.B11 52.7,80.52 57.02,76.2 57.02,74.04 64.01,67.06 78.87,67.06 80.26,65.66
DETB_SELECT01
  Top 0.127: U301.R11 80,56.91 78.74,58.17 78.74,65.15
  Top 0.203: 78.74,65.15 78.36,65.53 63.5,65.53 55.5,73.53 55.5,75.69 51.05,80.14 50.67,80.14 50.16,80.64 J402.B9
DETB_SELECT02
  Top 0.127: J402.A10 51.44,82.55 52.07,81.92 52.07,80.64 | U301.T9 79.88,59.11 79.88,65.53
  Top 0.203: 52.07,80.64 56.64,76.07 56.64,73.91 63.88,66.67 78.74,66.67 79.88,65.53
DETB_SELECT03  (via drill 0.25)
  Top 0.127: U301.N9 v82.82,56.88
  Top 0.203: J402.B7 v47.62,80.52
  Route14 0.127: v82.82,56.88 82.82,57.64 81.92,58.55 81.92,59.05 v77.72,63.25
  Route15 0.203: v77.72,63.25 73.41,67.56 65.79,67.56 53.72,79.63 48.01,79.63 47.62,80.01 v47.62,80.52
DETB_SELECT04  (via drill 0.25)
  Top 0.127: U301.N11 v81.41,55.46
  Top 0.203: J402.B5 v45.09,80.52
  Route14 0.127: v81.41,55.46 81.41,56.13 76.58,60.96 76.45,60.96 v76.2,61.21
  Route15 0.203: v76.2,61.21 71.37,66.04 65.28,66.04 53.21,78.11 46.99,78.11 45.09,80.01 v45.09,80.52
DETB_SELECT05  (via drill 0.25)
  Top 0.127: U301.P9 v82.12,57.58 | J402.A6 46.35,82.55 46.99,81.92 v46.99,80.26
  Route14 0.127: v82.12,57.58 | v82.12,57.58 81.53,58.17 81.53,58.55 v77.34,62.74
  Route15 0.203: v77.34,62.74 72.9,67.18 65.66,67.18 53.59,79.25 47.75,79.25 46.99,80.01 v46.99,80.26
DETB_SELECT06
  Top 0.127: U301.T2 85.65,69.78
  Top 0.203: J403.B11 87,71.12 85.65,69.78
DETB_SELECT07
  Top 0.127: U301.T4 84.24,62.06 84.07,62.23 84.07,70.74
  Top 0.203: J403.B9 84.45,71.12 84.07,70.74
DETB_SELECT08
  Top 0.127: 85.09,80.39 85.09,81.92 85.72,82.55 J403.A10 | U301.R4 84.95,61.87 84.45,62.36 84.45,70.48
  Top 0.203: 85.09,80.39 85.09,71.12 84.45,70.48
DETB_SELECT09  (via drill 0.25)
  Top 0.127: U301.P5 v84.95,60.41
  Top 0.203: J403.B7 81.92,80.01 82.55,79.38 v82.55,71.12
  Route14 0.127: v82.55,71.12 84.95,68.72 v84.95,60.41
DETB_SELECT10  (via drill 0.25)
  Top 0.127: U301.N8 v83.53,57.58
  Top 0.203: J403.B5 79.38,79.5 80.01,78.87 v80.01,70.61
  Route14 0.127: v83.53,57.58 83.53,58.33 82.93,58.93 82.93,67.69 v80.01,70.61
DETB_SELECT11  (via drill 0.25)
  Top 0.127: J403.A6 80.64,82.55 81.28,81.92 81.28,80.39 | U301.N6 v84.95,59
  Top 0.203: 81.28,80.39 81.28,79.88 81.92,79.25 v81.92,70.99
  Route14 0.127: v81.92,70.99 84.45,68.45 84.45,60.2 84.95,59.71 v84.95,59
DETB_SELECT12
  Top 0.127: U301.K2 89.9,59.8 90.55,60.45 90.55,66.04
  Top 0.203: J404.B11 121.28,79.38 112.01,70.1 94.61,70.1 90.55,66.04
DETB_SELECT13
  Top 0.127: U301.M2 88.48,61.18 89.03,61.72 89.03,67.06
  Top 0.203: J404.B9 118.75,79.88 110.49,71.63 93.6,71.63 89.03,67.06
DETB_SELECT14
  Top 0.127: J404.A10 120.02,82.55 119.38,81.92 119.38,80.52 | U301.M1 89.41,61.34 89.41,66.8
  Top 0.203: 119.38,80.52 119.38,79.76 110.87,71.25 93.85,71.25 89.41,66.8
DETB_SELECT15  (via drill 0.25)
  Top 0.127: U301.J4 v89.19,57.58
  Top 0.203: J404.B7 116.2,78.99 109.73,72.52 v96.77,72.52
  Route14 0.127: v89.19,57.58 89.19,58.33 89.79,58.93 89.79,65.53 v96.77,72.52
DETB_SELECT16  (via drill 0.25)
  Top 0.127: U301.L4 v87.77,59
  Top 0.203: J404.B5 113.67,80.01 107.82,74.17 95.38,74.17 v94.23,73.03
  Route14 0.127: v87.77,59 87.77,59.71 88.27,60.2 88.27,67.06 v94.23,73.03
DETB_SELECT17  (via drill 0.25)
  Top 0.127: J404.A6 114.94,82.55 114.3,81.92 114.3,80.52 | U301.L3 v88.48,59.7
  Top 0.203: 114.3,80.52 114.3,79.76 108.33,73.79 95.76,73.79 v94.87,72.9
  Route14 0.127: v88.48,59.7 88.48,59.78 88.65,59.94 88.65,66.67 v94.87,72.9
DETB_SELECT19
  Top 0.127: U301.H2 92,57.58 94.11,59.69
  Top 0.203: 94.11,59.69 94.11,61.59 97.03,64.52 J305.6
DETB_SELECT20
  Top 0.127: U301.G1 92.72,57.67 94.61,59.56
  Top 0.203: 94.61,59.56 94.61,60.83 97.03,63.25 J305.4
DETB_SELECT22  (via drill 0.25)
  Top 0.127: U301.H4 v90.6,56.17
  Bottom 0.127: v90.6,56.17 91.6,56.17 91.69,56.26 92.33,56.26 TP305.P$1
DETB_STATUS_SELECT0
  Top 0.127: U301.R6 83.53,60.36 82.93,60.96 82.93,65.53
  Top 0.203: J402.B16 59.05,74.8 64.9,68.96 79.5,68.96 82.93,65.53
DETB_STATUS_SELECT1
  Top 0.127: U301.N2 87.77,61.87 88.27,62.36 88.27,69.34
  Top 0.203: J403.B16 93.34,80.64 89.53,76.83 89.53,70.61 88.27,69.34
DETB_STATUS_SELECT2
  Top 0.127: U301.J2 91.31,58.29 92.08,59.05 92.08,65.02
  Top 0.203: J404.B16 127.64,80.52 126.87,79.76 124.71,79.76 113.54,68.58 95.63,68.58 92.08,65.02
DETB_TRIGGER0
  Top 0.127: U301.T7 82.12,59.74 81.41,60.45 81.41,66.04
  Top 0.203: J402.B14 56.52,80.64 58.17,78.99 58.17,74.42 64.39,68.2 79.25,68.2 81.41,66.04
DETB_TRIGGER1
  Top 0.127: U301.P2 87.07,62.56 87.5,62.99 87.5,70.1
  Top 0.203: J403.B14 90.81,80.64 88.27,78.11 88.27,70.87 87.5,70.1
DETB_TRIGGER2
  Top 0.127: U301.J3 89.9,58.27 91.31,59.69 91.31,65.53
  Top 0.203: 91.31,65.53 95.12,69.34 112.78,69.34 123.95,80.52 124.97,80.52 125.09,80.64 J404.B14
EXP_J303_D0  (via drill 0.25)
  Top 0.127: U301.C5 v93.43,51.93
  Top 0.203: v119.13,49.91 J303.2
  Route14 0.127: v93.43,51.93 93.43,51.86 93.6,51.69 105.28,51.69
  Route14 0.203: 105.28,51.69 117.35,51.69 v119.13,49.91
EXP_J303_D1  (via drill 0.25)
  Top 0.127: U301.D6 v92.02,51.93
  Top 0.203: v119.13,48.64 J303.4
  Route14 0.127: v92.02,51.93 92.47,51.93 93.09,51.31 105.28,51.31
  Route14 0.203: 105.28,51.31 116.46,51.31 v119.13,48.64
EXP_J303_D2  (via drill 0.25)
  Top 0.127: U301.D7 v91.31,51.22
  Top 0.203: v119.13,47.37 J303.6
  Route14 0.127: v91.31,51.22 92.16,51.22 92.46,50.93 105.28,50.93
  Route14 0.203: 105.28,50.93 115.57,50.93 v119.13,47.37
EXP_J303_D3  (via drill 0.25)
  Top 0.127: U301.C7 v92.02,50.51
  Top 0.203: v119.13,46.1 J303.8
  Route14 0.127: v92.02,50.51 92.42,50.51 92.46,50.55 105.28,50.55
  Route14 0.203: 105.28,50.55 115.19,50.55 115.82,49.91 115.82,49.4 v119.13,46.1
EXP_J304_D0
  Top 0.127: U301.H16 80.08,46.35 79.88,46.35
  Top 0.203: 79.88,46.35 76.96,43.43 68.71,43.43 67.31,44.83 64.52,44.83 63.37,45.97 63.37,50.8 65.66,53.09 65.66,59.56 64.77,60.45 J304.2
EXP_J304_D1
  Top 0.127: U301.H15 82.12,47.7 80.39,45.97 80.14,45.97
  Top 0.203: 80.14,45.97 77.22,43.05 68.45,43.05 67.06,44.45 64.26,44.45 62.99,45.72 62.99,51.05 65.28,53.34 65.28,58.42 64.52,59.18 J304.4
EXP_J304_D2
  Top 0.127: U301.G16 81.03,45.88 81.03,45.09
  Top 0.203: 81.03,45.09 80.77,44.83 79.63,44.83 77.47,42.67 68.2,42.67 66.8,44.07 64.01,44.07 62.61,45.47 62.61,51.31 64.9,53.59 64.9,57.28 64.26,57.91 J304.6
EXP_J304_D3
  Top 0.127: U301.G15 82.82,47.01 81.41,45.59 81.41,44.83
  Top 0.203: 81.41,44.83 81.03,44.45 79.88,44.45 77.72,42.29 67.94,42.29 66.55,43.69 63.75,43.69 62.23,45.21 62.23,51.56 64.52,53.85 64.52,56.26 64.14,56.64 J304.8
FAN1_EN  (via drill 0.25)
  Top 0.127: U201.36 69.4,16.06 69.34,16
  Top 0.203: 69.34,16 v61.21,16 | v12.06,25.15 11.56,24.64 R222.1
  Route15 0.203: v61.21,16 60.71,16.51 60.71,27.69 53.09,35.31 48.77,35.31 45.21,31.75 25.91,31.75 21.08,26.92 17.27,26.92 15.49,25.15 v12.06,25.15
FAN1_SENSE  (via drill 0.25)
  Top 0.127: U201.37 69.38,15.66 69.34,15.62
  Top 0.203: 69.34,15.62 62.1,15.62 v61.85,15.37 61.72,15.24 R220.1 | D204.4 59.5,9.21 v59.69,9.4
  Bottom 0.203: v59.69,9.4 59.69,10.29 60.96,11.56 60.96,14.48 v61.85,15.37
FAN2_EN  (via drill 0.25)
  Top 0.127: U201.2 80.56,14.06 80.64,13.97
  Top 0.203: 80.64,13.97 84.07,13.97 v84.33,13.72 | v83.57,30.23 R226.1
  Bottom 0.203: v84.33,13.72 84.33,23.11 83.06,24.38 83.06,29.72 v83.57,30.23
FAN2_SENSE  (via drill 0.25)
  Top 0.127: U201.3 80.67,14.46 80.77,14.35
  Top 0.203: 80.77,14.35 84.71,14.35 v84.96,14.1 | v84.58,30.23 R225.1
  Bottom 0.203: v84.96,14.1 84.71,14.35 84.71,23.11 85.6,24 85.6,29.21 v84.58,30.23
FP_LED0  (via drill 0.25)
  Top 0.127: U301.A15 87.11,43.44 87.63,42.93 87.88,42.93 90.42,40.39
  Top 0.203: 90.42,40.39 92.46,38.35 v92.46,32.77 | v100.71,6.73 v100.71,6.72 R308.2
  Bottom 0.203: v100.71,6.73 96.77,10.67 96.77,18.03 90.68,24.13 90.68,30.99 v92.46,32.77
FP_LED1  (via drill 0.25)
  Top 0.127: U301.B14 87.07,44.12 87.88,43.31 88.14,43.31 90.81,40.64
  Top 0.203: 90.81,40.64 93.22,38.23 v93.22,33.02 | v102.49,6.73 v102.49,6.72 R309.2
  Bottom 0.203: v102.49,6.73 97.28,11.94 97.28,20.07 93.22,24.13 v93.22,33.02
FP_LED2  (via drill 0.25)
  Top 0.127: 91.19,40.89 88.19,43.89 88.03,43.89 U301.A14
  Top 0.203: 91.19,40.89 94.11,37.97 v94.11,33.27 | v104.27,6.73 v104.27,6.72 R310.2
  Bottom 0.203: v104.27,6.73 97.79,13.21 97.79,22.1 95.76,24.13 95.76,31.62 v94.11,33.27
FP_LED3  (via drill 0.25)
  Top 0.127: U301.B13 87.77,44.94 91.57,41.15
  Top 0.203: 91.57,41.15 94.74,37.97 v94.74,33.53 | v106.05,6.73 v106.05,6.72 R311.2
  Bottom 0.203: v106.05,6.73 98.3,14.48 98.3,29.97 v94.74,33.53
FP_LED4  (via drill 0.25)
  Top 0.127: U301.K13 v81.41,51.22
  Top 0.203: R313.2 108.71,5.84 v107.82,6.73
  Route14 0.127: v81.41,51.22 80.68,51.22 78.99,49.53 77.34,49.53 v77.22,49.4
  Bottom 0.203: v77.22,49.4 77.22,46.48 83.31,40.39 88.9,40.39 100.84,28.45 100.84,13.72 v107.82,6.73
FP_LED5  (via drill 0.25)
  Top 0.127: U301.J13 v82.12,50.51
  Top 0.203: R314.2 110.49,5.84 v109.6,6.73
  Route14 0.127: v82.12,50.51 81.37,50.51 79.88,49.02 v77.72,49.02
  Bottom 0.203: v77.72,49.02 77.72,46.74 83.57,40.89 89.15,40.89 99.82,30.23 101.85,30.23 103.38,28.7 103.38,12.95 v109.6,6.73
FP_SCL
  Top 0.127: U301.A9 91.38,47.68 94.87,44.2
  Top 0.203: R301.1 R303.1 112.52,42.04 108.97,38.48 100.58,38.48 94.87,44.2
FP_SDA
  Top 0.127: U301.C9 89.9,48.41 94.49,43.81
  Top 0.203: R302.1 R304.1 112.14,40.89 109.22,37.97 100.33,37.97 94.49,43.81
FT_VREGOUT  (via drill 0.25)
  Top 0.203: U604.12 44.93,12.67 v44.96,12.7 | U604.64 38.42,13.27 38.61,13.08 v38.61,12.7 | U604.37 44.93,21.36 v44.96,21.34 | U604.49 38.42,20.77 v38.86,21.21
  Bottom 0.203: v44.96,21.34 44.96,21.98 C626.1 | C610.1 v38.87,21.22 v38.86,21.21 | C624.1 38.23,12.19 38.23,12.32 v38.61,12.7 | C625.1 v44.97,12.69 v44.96,12.7
  pour Route15 (isolate 0.203): 36.58,21.34 38.86,23.62 47.5,23.62 49.78,21.34 49.78,12.7 47.5,10.41 38.86,10.41 36.58,12.7
FTA_CTS#
  Top 0.203: U604.19 51.35,14.27 52.32,15.24 52.32,17.78 51.56,18.54 51.56,19.87 U605.13
FTA_RTS#  (via drill 0.25)
  Top 0.203: U604.18 51.61,13.77 52.83,14.99 52.83,18.03 52.58,18.29 52.58,19.05 v52.32,19.3 | v51.05,20.57 51.05,21.16 U605.11
  Bottom 0.203: v52.32,19.3 v51.05,20.57
FTA_RXD
  Top 0.203: U605.14 53.89,21.25 53.09,20.45 53.09,18.54 53.34,18.29 53.34,14.73 51.88,13.27 U604.17
FTA_RXLED#
  Top 0.203: U604.29 50.07,19.27 50.42,18.92 50.42,17.52 R612.1
FTA_TXD  (via drill 0.25)
  Top 0.203: U604.16 46.93,12.26 47.24,12.57 51.94,12.57 53.85,14.48 v53.85,18.8 | U605.12 51.75,20.95 v51.69,20.95
  Bottom 0.203: v53.85,18.8 v51.69,20.95
FTA_TXLED#
  Top 0.203: U604.30 50.34,19.77 50.93,19.18 50.93,18.29 51.44,17.78 51.44,17.52 R613.1
FTB_CTS#  (via drill 0.25)
  Top 0.203: U604.41 42.93,24.64 44.45,26.16 v44.45,26.42 | v46.23,24.64 46.23,24.77 47.37,25.91 47.44,25.91 U606.13
  Bottom 0.203: v44.45,26.42 v46.23,24.64
FTB_RTS#
  Top 0.203: U604.40 43.43,24.38 45.34,26.29 45.34,26.54 45.72,26.92 46.66,26.92 U606.11
FTB_RXD  (via drill 0.25)
  Top 0.203: U604.39 43.93,24.12 45.97,26.16 v45.97,26.42 | v47.37,25.02 47.45,25.02 U606.14
  Bottom 0.203: v45.97,26.42 v47.37,25.02
FTB_RXLED#
  Top 0.203: U604.54 36.34,18.27 36.07,18.54 R614.1
FTB_TXD
  Top 0.203: U604.38 44.43,23.86 46.99,26.42 47.05,26.42 U606.12
FTB_TXLED#
  Top 0.203: U604.55 36.31,17.77 36.07,17.53 R615.1
GND  (via drill 0.25)
  Top 0.127: U301.J9 v84.95,53.34 | U301.H8 v87.77,53.34 | v87.77,53.34 | U301.H9 v86.36,51.93 | v86.36,51.93 | U301.J8 v86.36,54.75 | U301.L6 v86.36,57.58 | U301.M5 v86.36,59 | U301.L11 v82.12,53.34 | U301.M12 v80.7,53.34 | U301.N13 v79.29,53.34 | U301.P14 v77.88,53.34 | U301.R15 v76.46,53.34 | U301.F11 v86.36,49.1 | v86.36,49.1 | U301.E12 v86.36,47.68 | v86.36,47.68 | U301.D13 v86.36,46.27 | v86.36,46.27 | U301.C14 v86.36,44.85 | v86.36,44.85 | U301.B15 v86.36,43.44 | v86.36,43.44 | U301.B2 v96.26,53.34 | v96.26,53.34 | U301.C3 v94.84,53.34 | v94.84,53.34 | U301.D4 v93.43,53.34 | v93.43,53.34 | U301.E5 v92.02,53.34 | v92.02,53.34 | U301.F6 v90.6,53.34 | v90.6,53.34 | U301.N4 v86.36,60.41 | U301.R2 v86.36,63.24 | U301.P3 v86.36,61.83 | U201.19 76.18,20.94 76.33,21.08 v76.33,21.46 | U603.4 v67.69,46.48
  Top 0.203: U803.D4 v10.03,47.62 | U803.H1 v13.84,53.98 | U803.G1 v13.84,52.7 | R218.1 v85.47,6.99 | S101.1 89.68,1.38 v89.66,1.4 | LED201.C 95.87,1.54 v95.89,1.52 95.9,1.54 LED202.C | LED102.C 115.3,1.52 v114.43,1.52 113.55,1.52 LED101.C | R805.2 v44.2,33.78 | U802.G1 v41.78,36.96 | U802.H1 v43.05,36.96 | U801.G1 v41.78,50.93 | U801.H1 v43.05,50.93 | R801.2 v43.18,47.75 | U801.D4 v36.7,54.74 | U802.D4 v36.7,40.77 | v96.01,48.13 95.53,47.65 XO301.2 94.84,47.65 v94.36,48.13 | R312.1 98.94,45.97 v98.55,45.97 | v128.65,37.72 D202.2 | J204.1 v66.8,24.51 | J204.3 v65.53,24.51 | J204.5 v64.26,24.51 | X201.2 74.93,22.94 v74.93,21.97 | X201.4 76.71,25.32 v76.71,26.42 | C206.2 v77.98,25.4 76.83,25.4 76.71,25.27 | C205.2 v73.53,26.42 | v86.87,35.56 88.07,35.56 C915.2 88.2,35.56 v89.41,35.56 | R517.1 62.1,6.47 v62.1,5.71 | U201.PAD v74.17,15.24 | R807.2 v17.14,53.59 | J401.A1 v5.71,83.57 | J401.B1 v5.71,80.52 | J204.7 62.99,25.15 v63.75,25.91 | U605.2 59.01,25.53 v59.05,25.53 | U605.8 55.88,27.78 v55.88,28.57 | U606.2 53.81,30.48 v54.36,30.48 | U606.8 51.31,33.37 v51.31,33.53 | C1010.2 v59.18,13.21 | U1005.2 31.75,30.23 32,30.48 32.13,30.48 32.4,30.21 U1005.1 32.4,29.72 v33.27,29.72 | LED203.C 97.67,1.54 v97.66,1.52 | D204.2 v55.12,10.16 | D503.2 v60.45,10.16 | C204.2 57.02,13.21 v56.39,12.57 | R519.1 56.77,6.47 v56.77,5.71 | R210.1 57.4,14.47 v57.4,14.99 | J103.1 119.4,36.55 v119.38,36.58 | J304.3 v57.53,59.18 | J304.5 v57.53,57.91 | J304.7 v57.53,56.64 | J304.9 v57.53,55.37 | U701.1_24 32.67,70.87 32.38,70.87 32.38,70.1 32.26,69.98 | 32.26,69.98 32.25,69.97 | v32.77,69.98 32.26,69.98 | R217.1 11.42,23.87 v11.43,23.88 | R804.2 v43.05,48.39 | J304.1 58.42,60.45 58.17,60.2 57.78,60.2 v56.77,59.18